# Altium schematic sheet ad.SchDoc
size A0
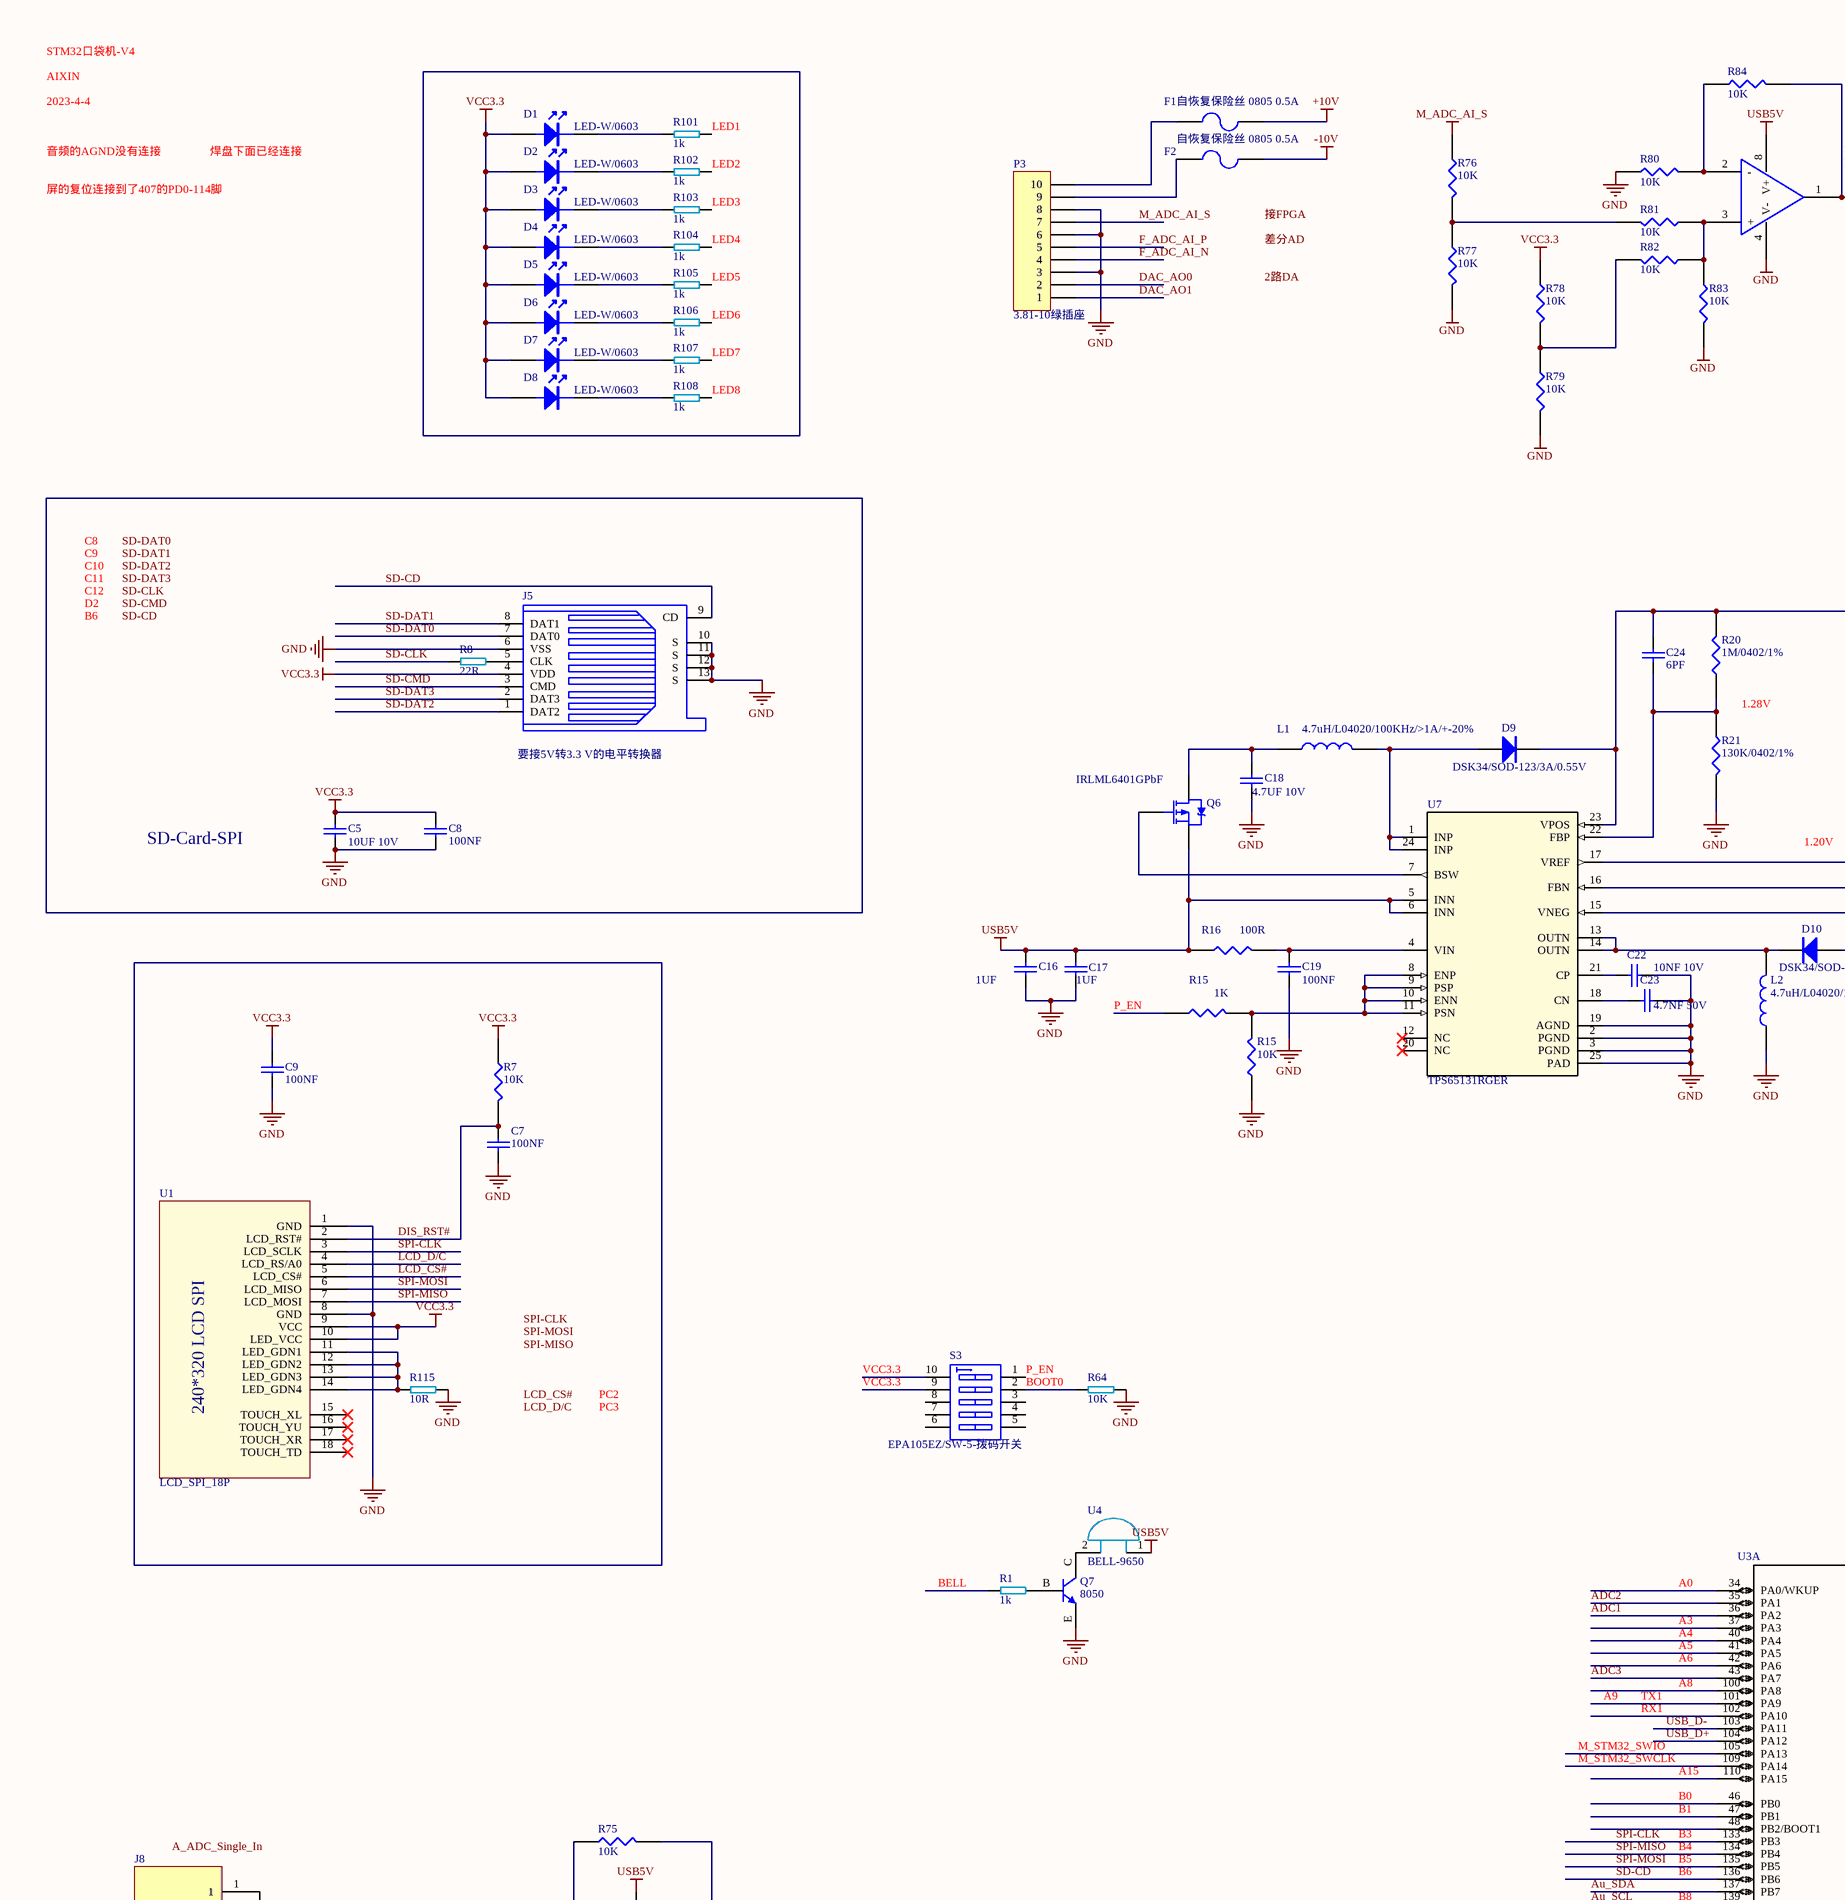
[diagram p0: ad.SchDoc, top left]
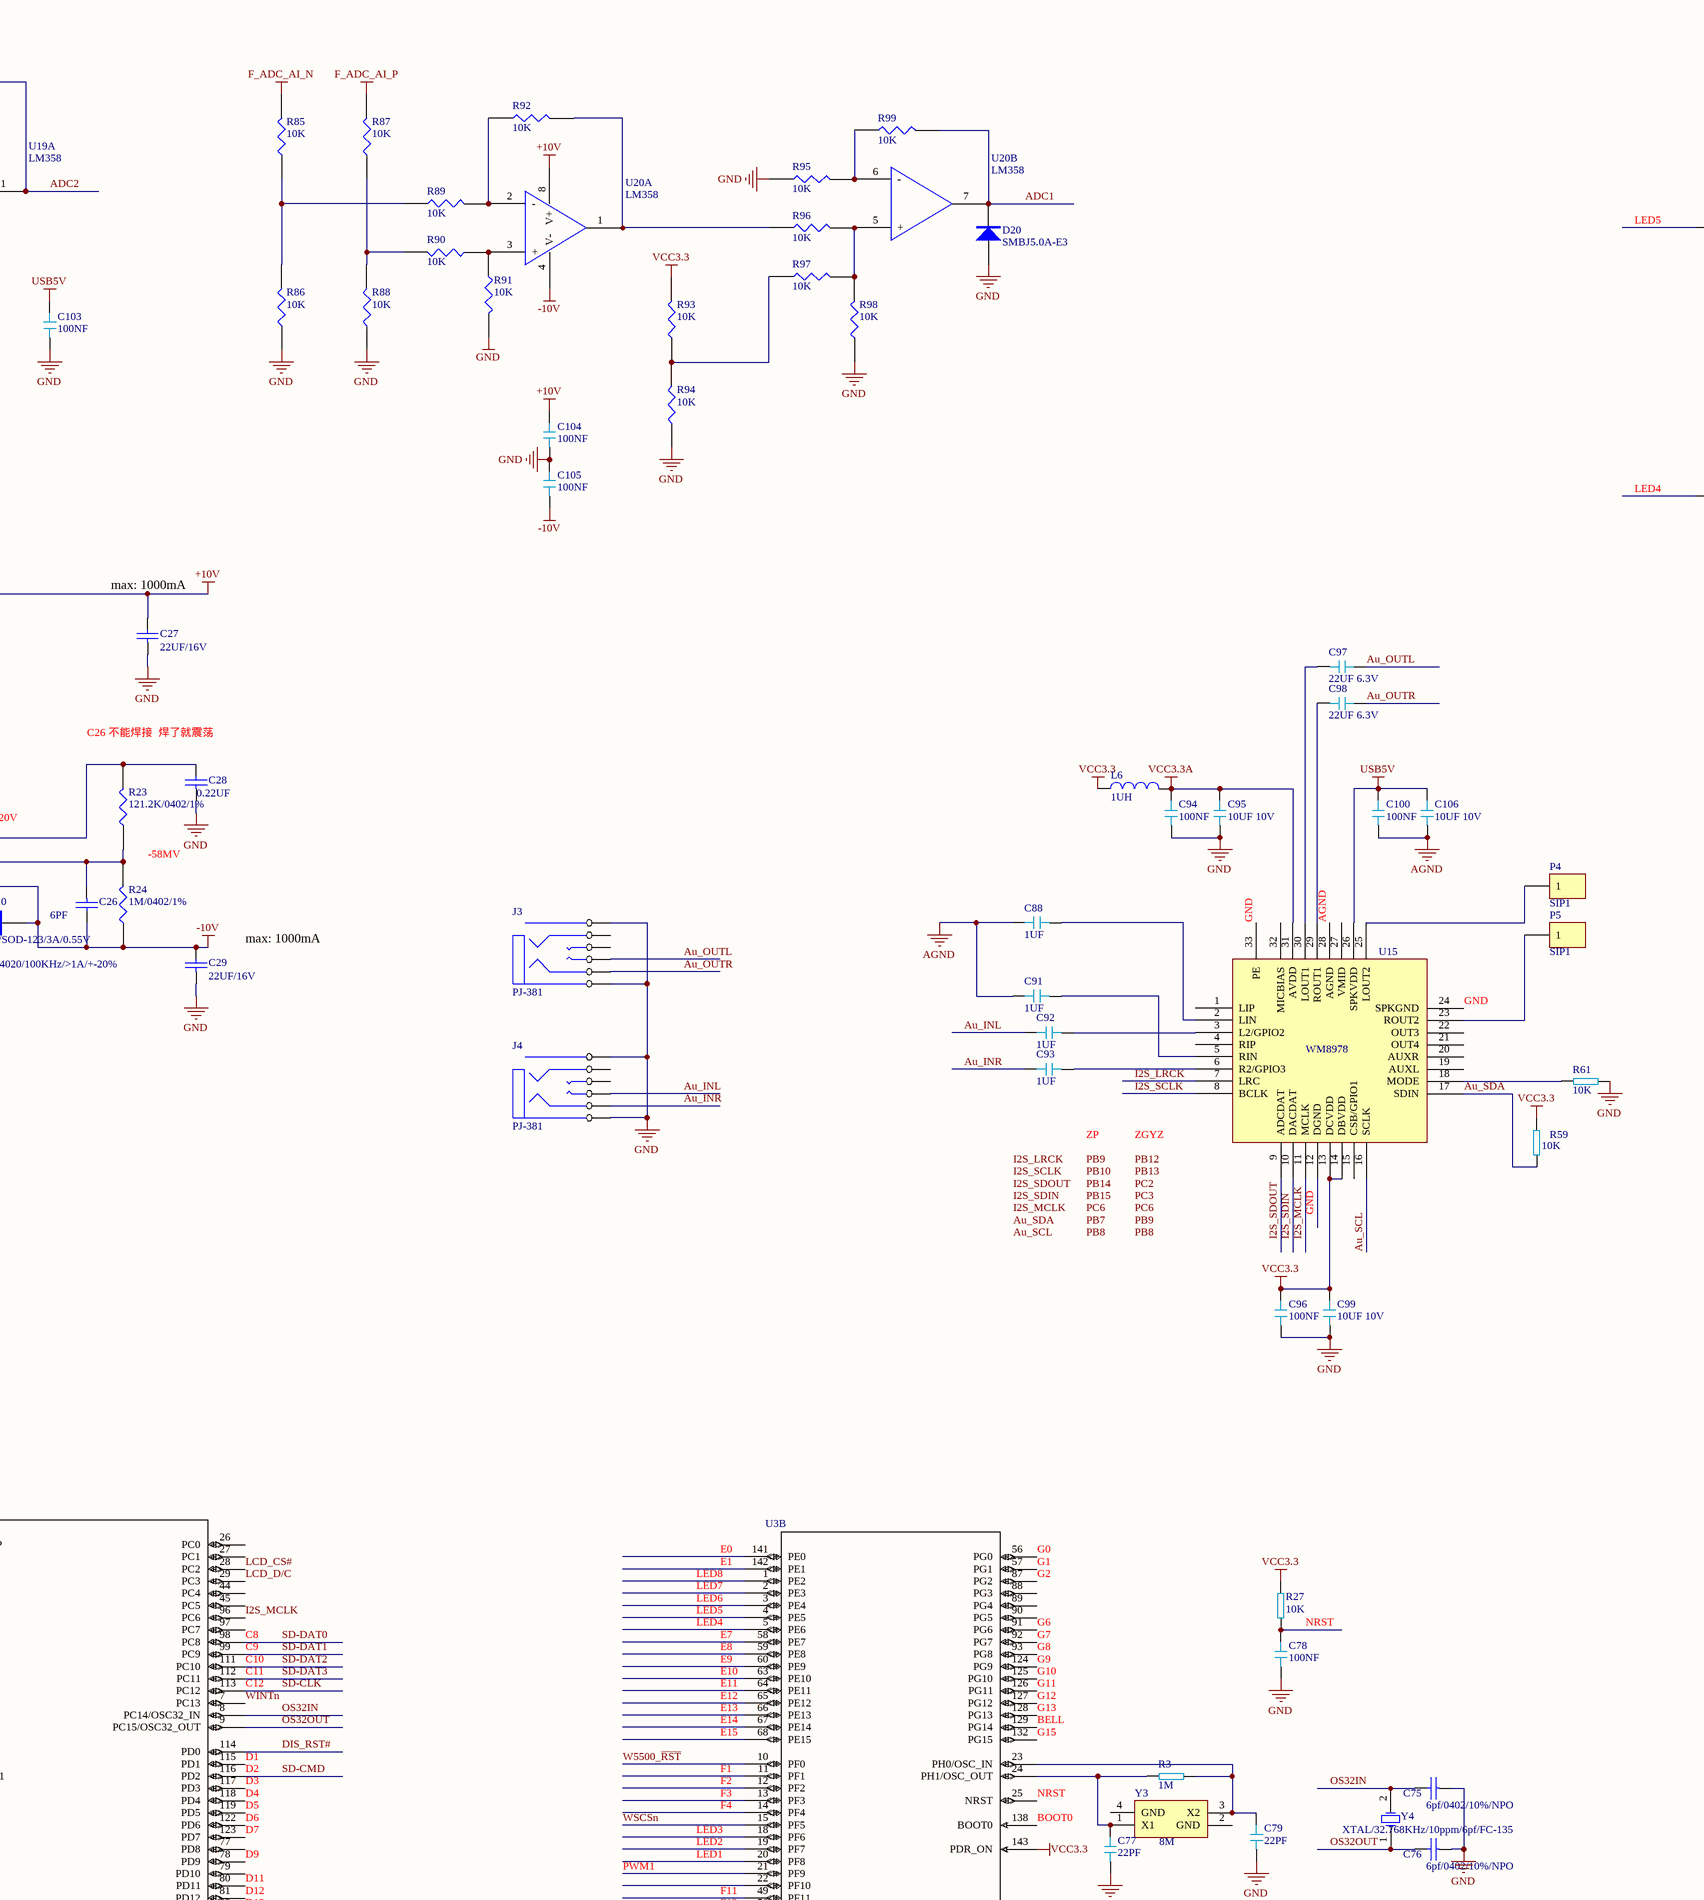
[diagram p1: ad.SchDoc, top middle]
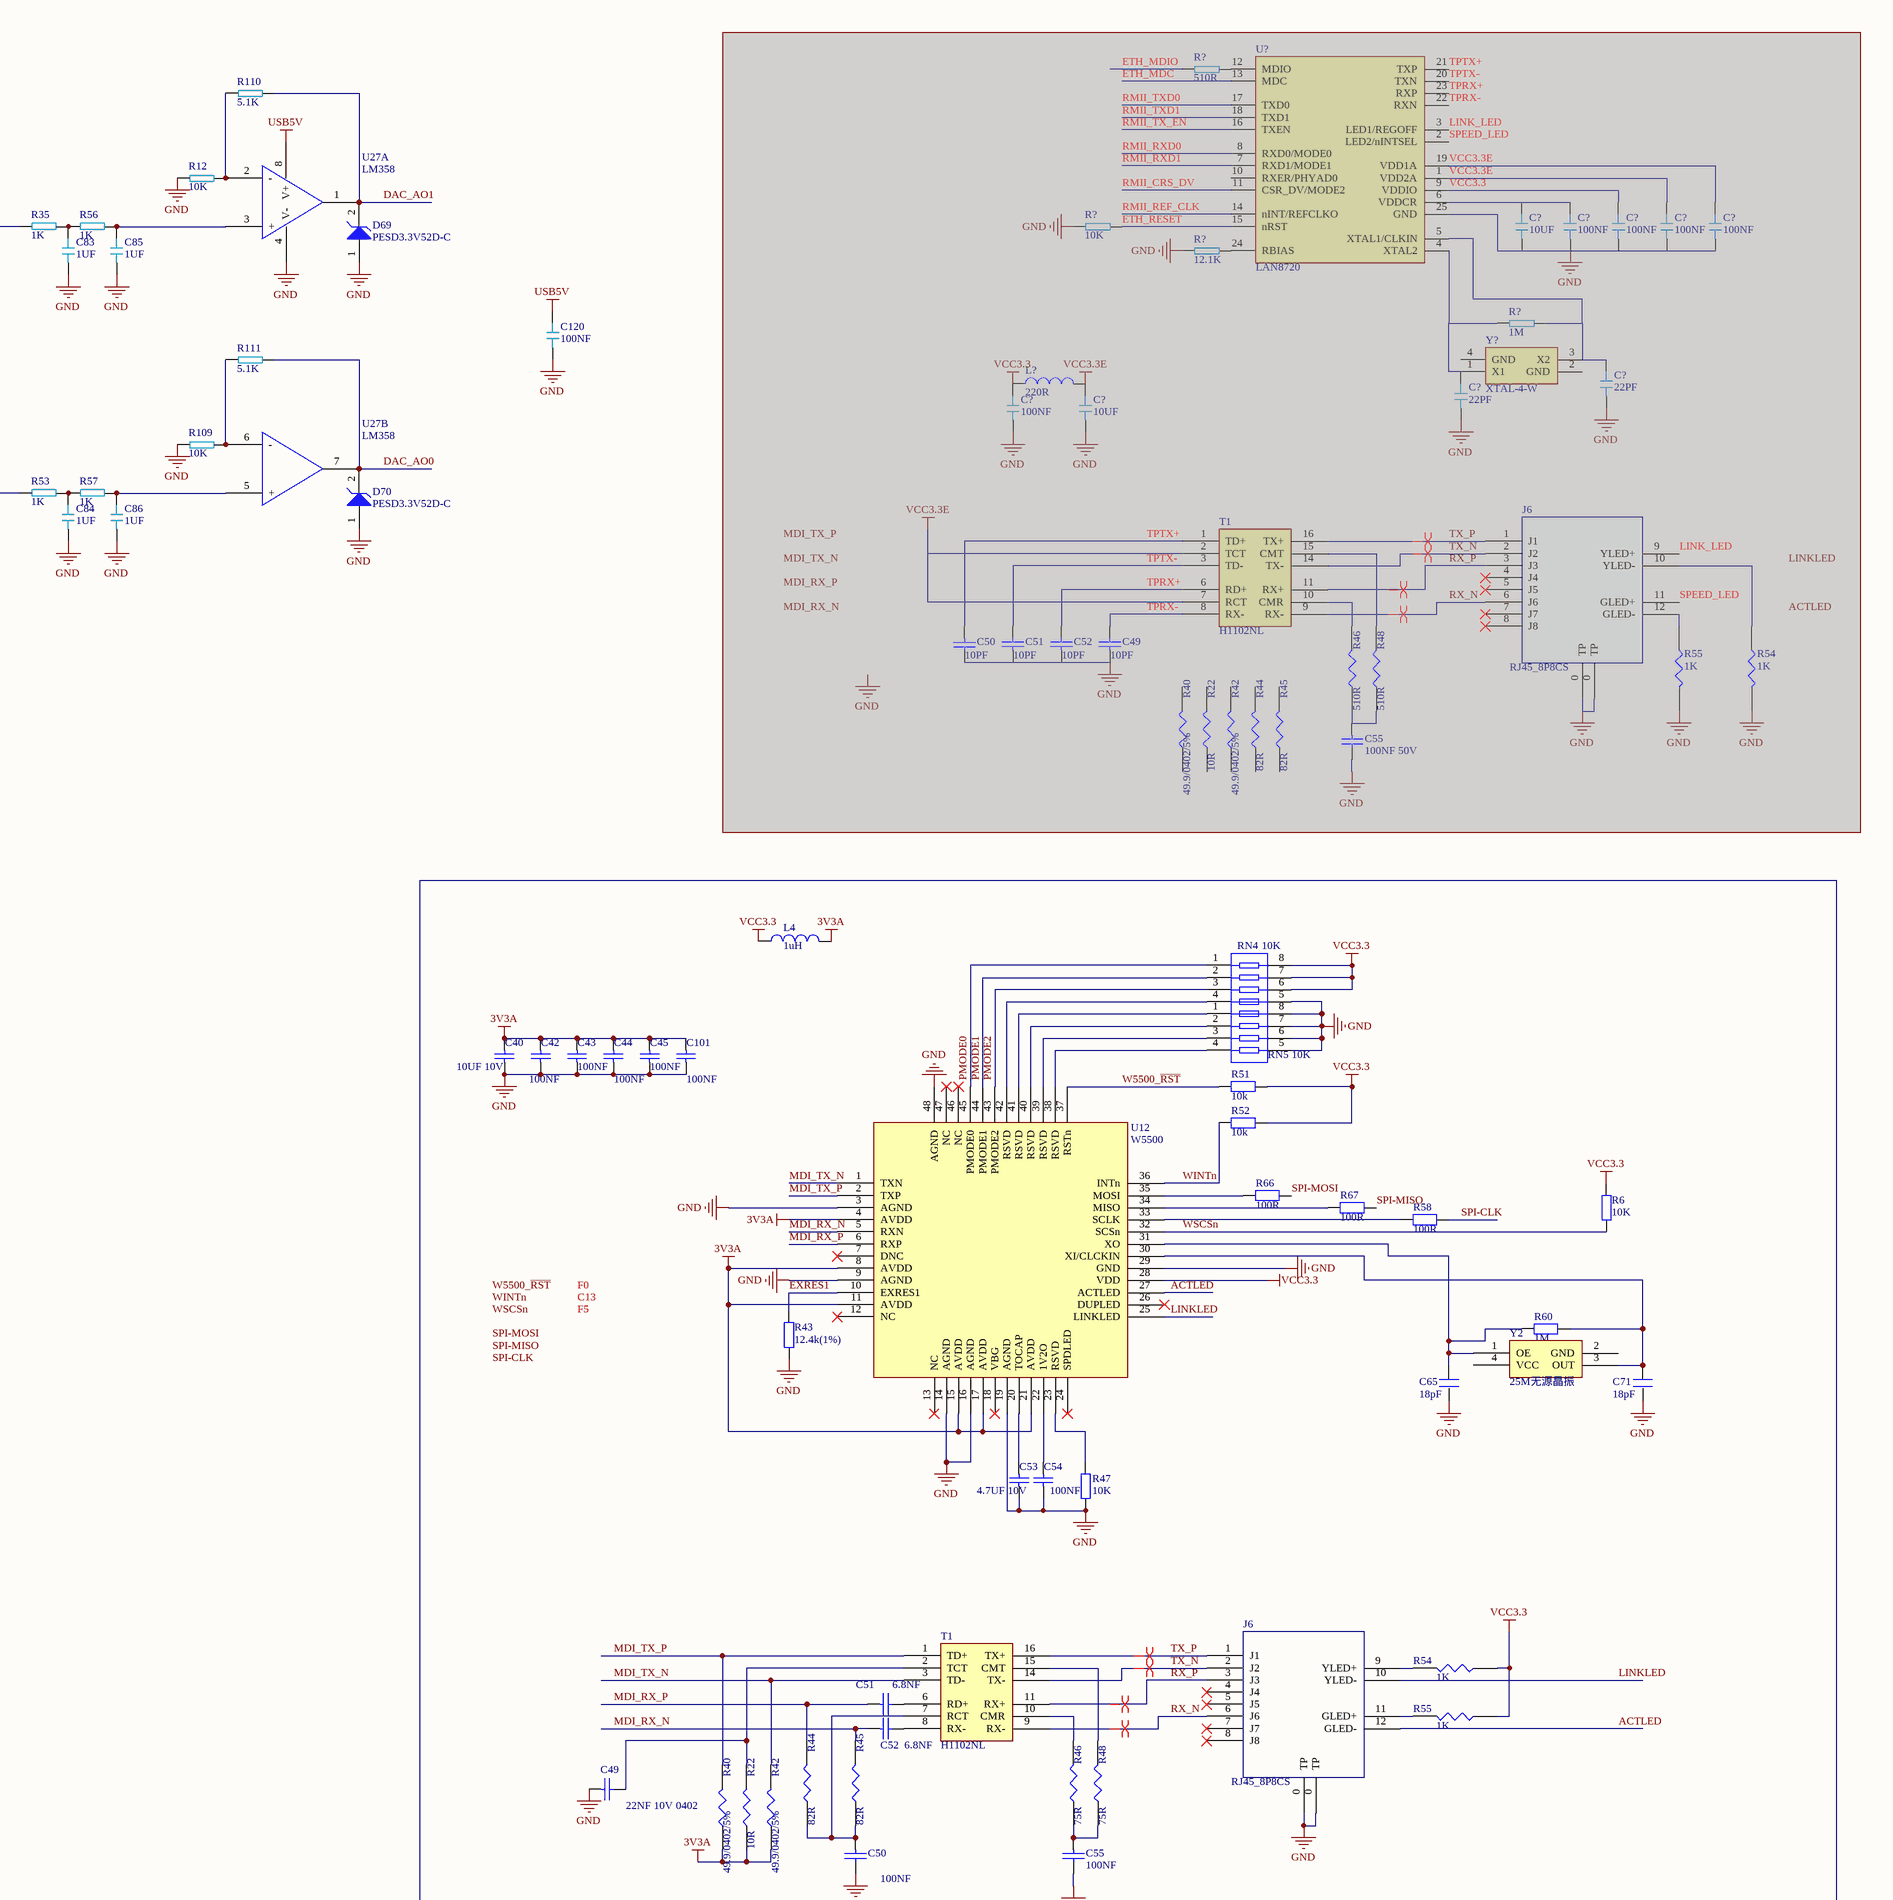
[diagram p2: ad.SchDoc, top right]
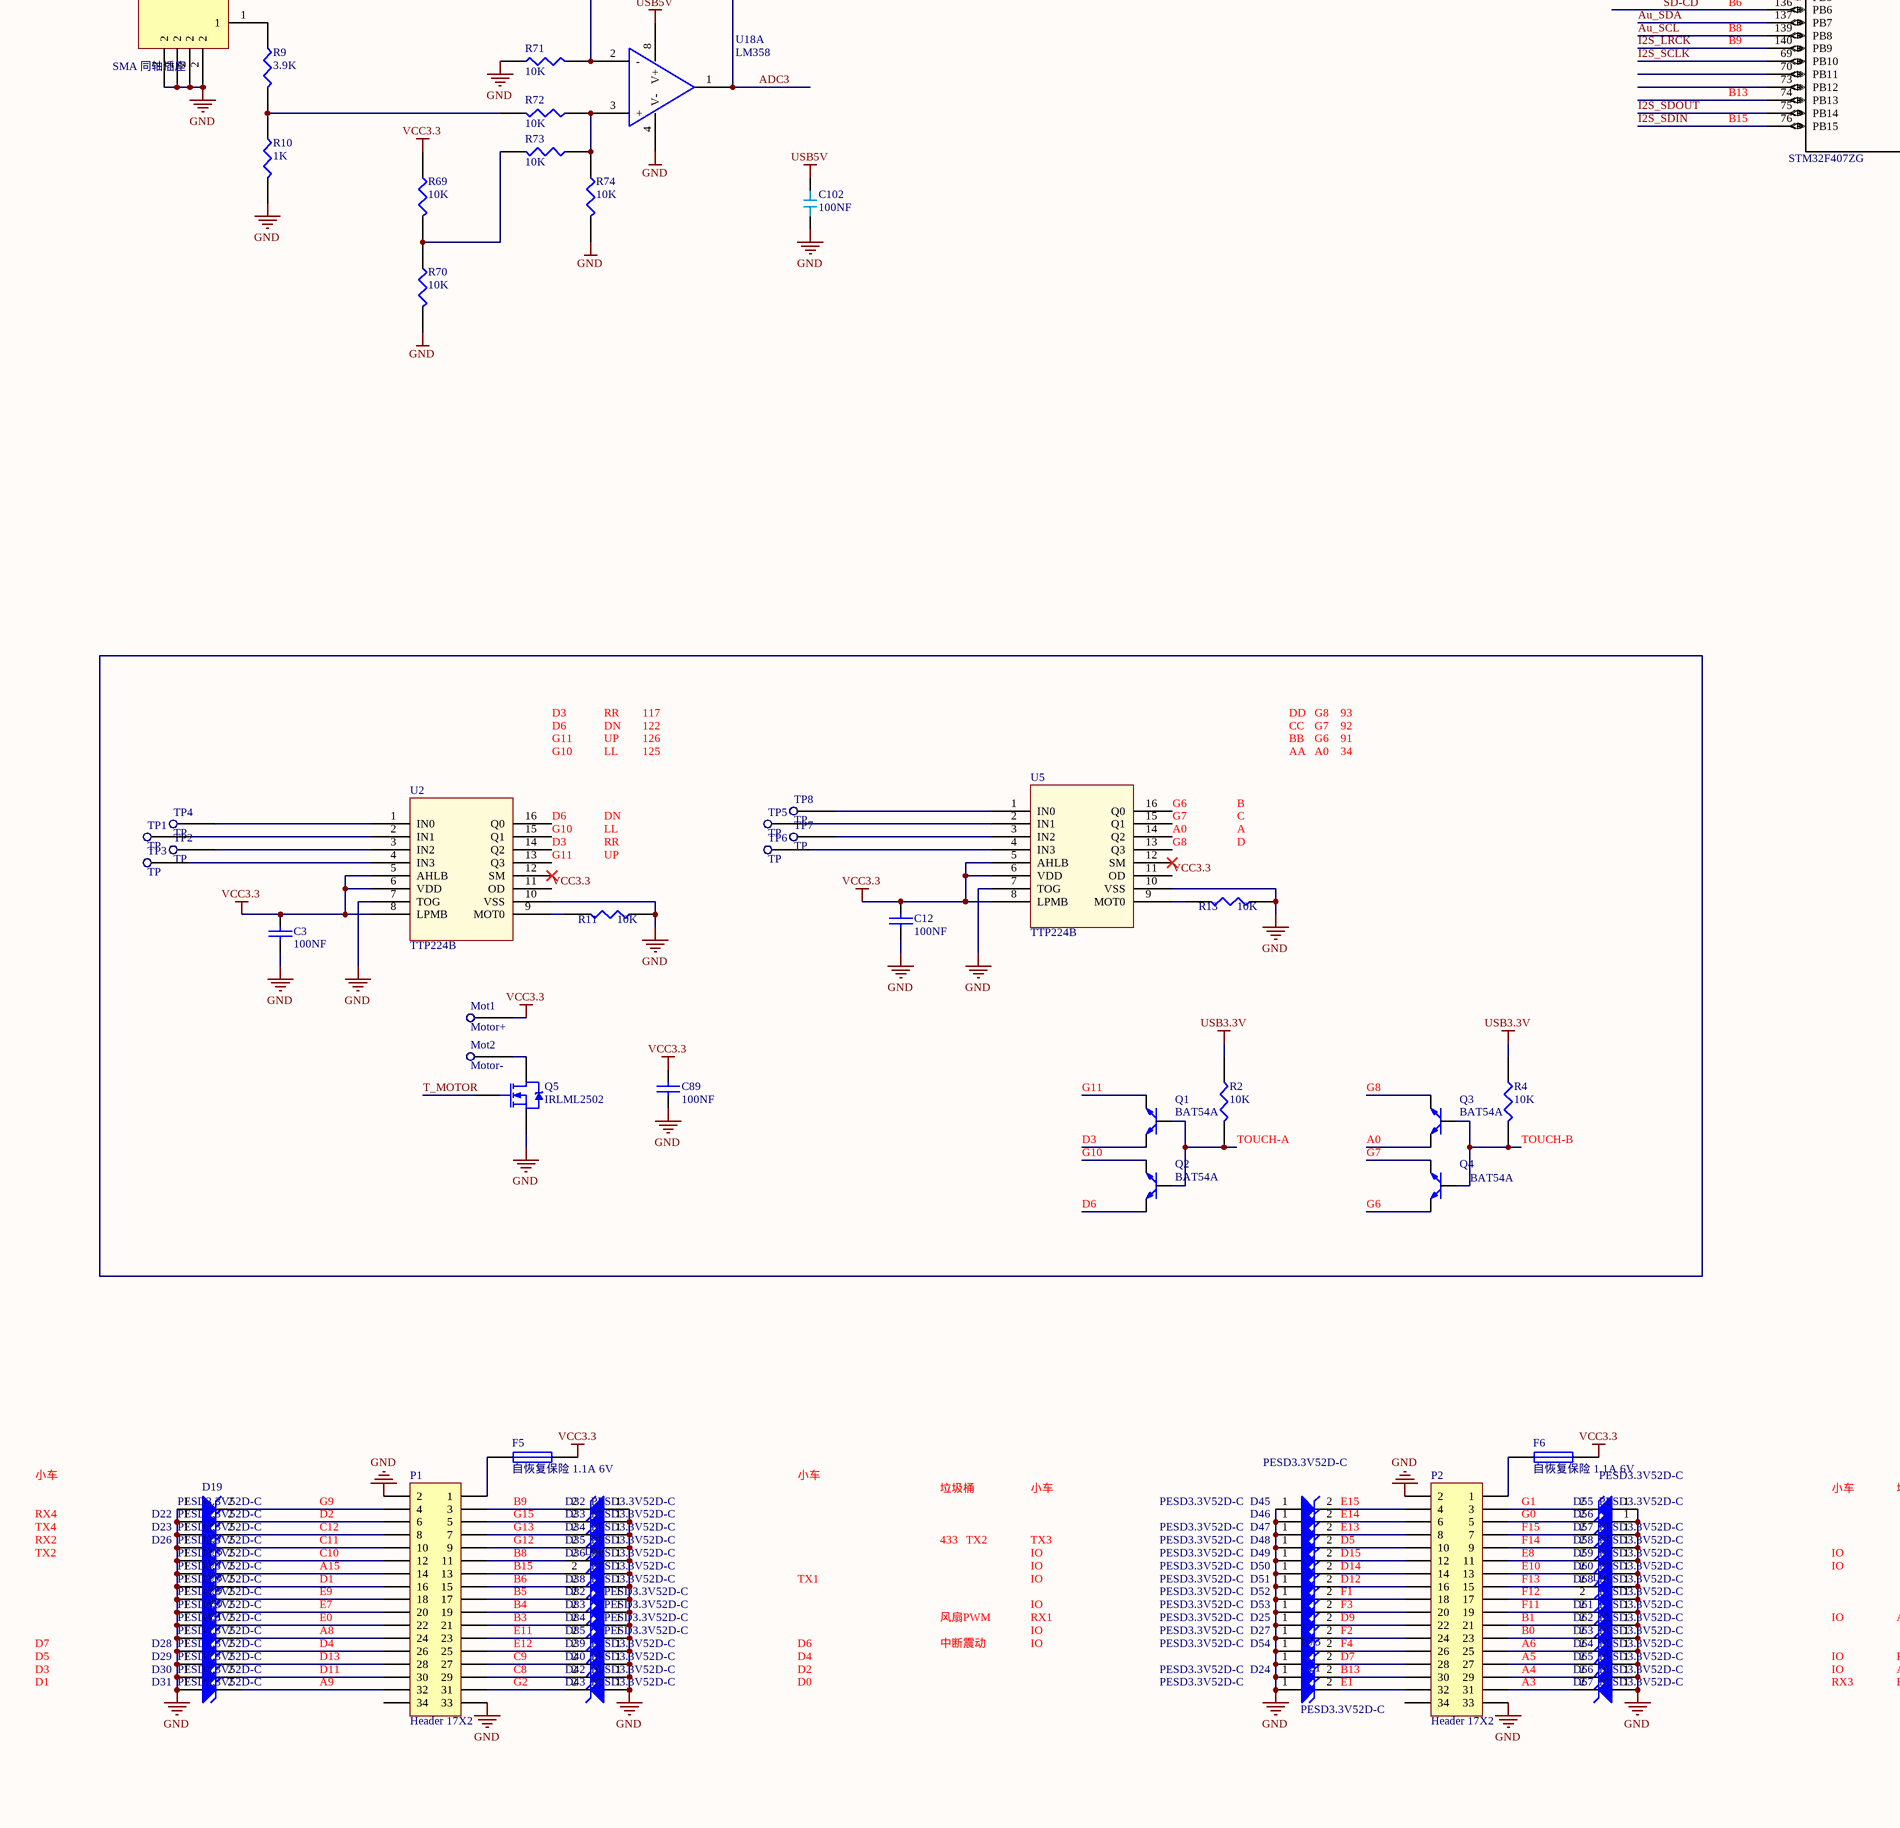
[diagram p3: ad.SchDoc, bottom left]
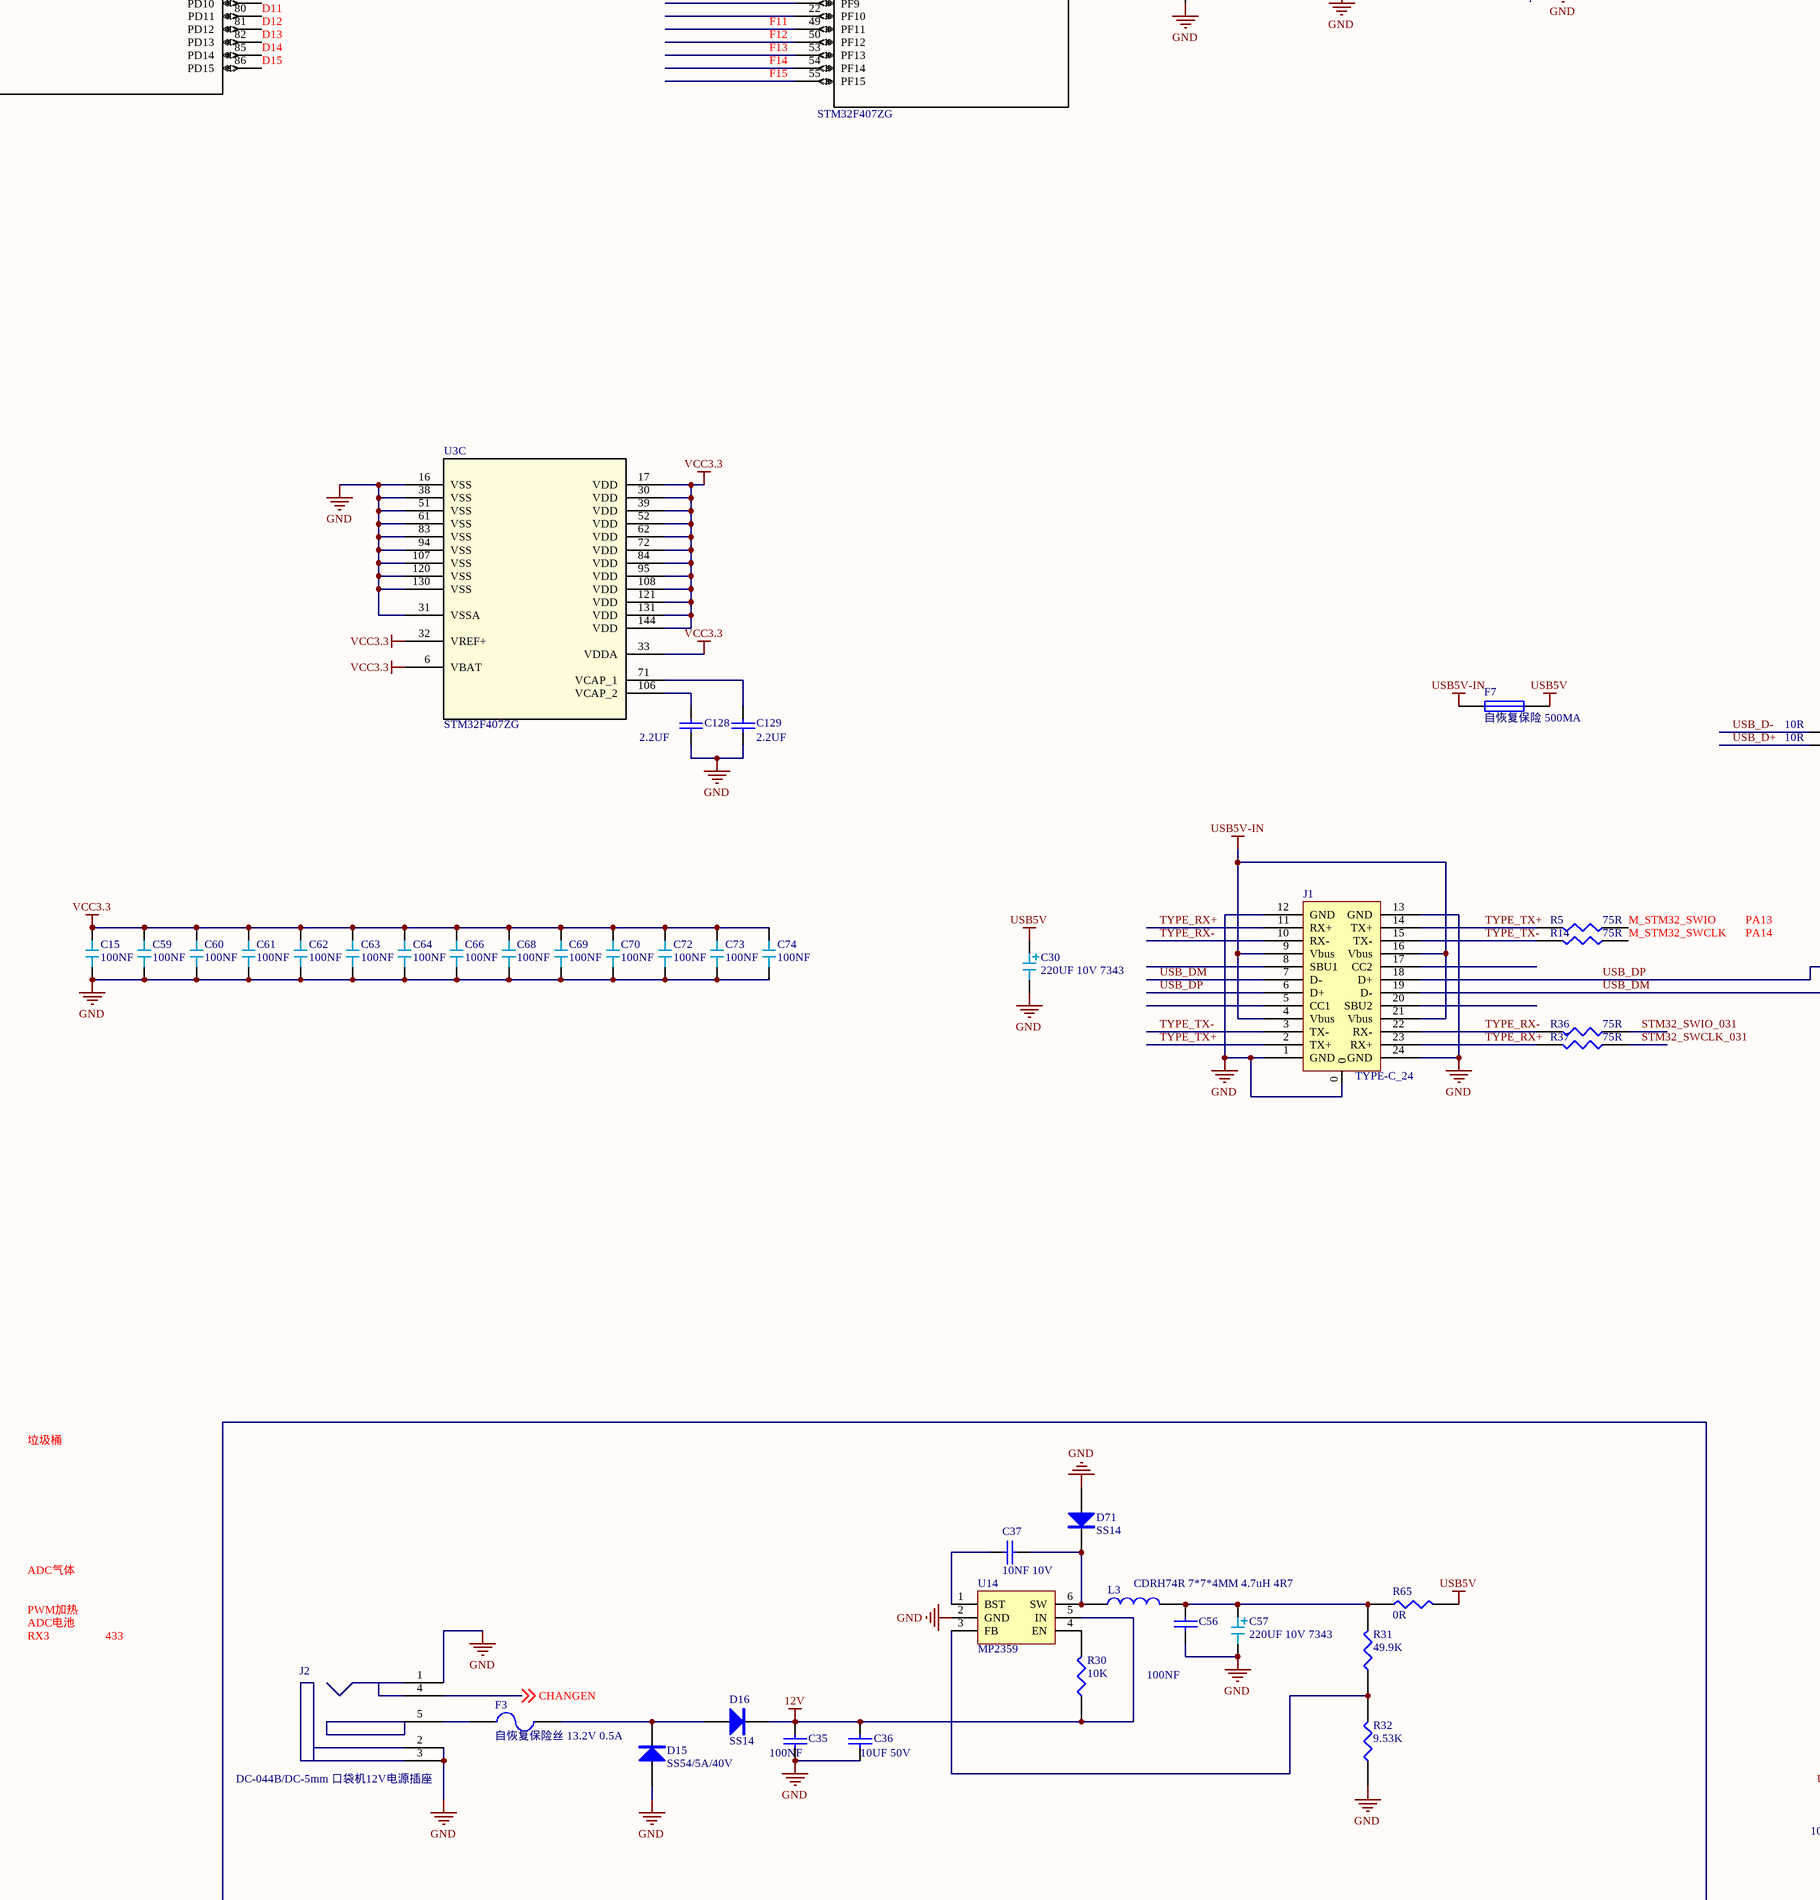
[diagram p4: ad.SchDoc, bottom middle]
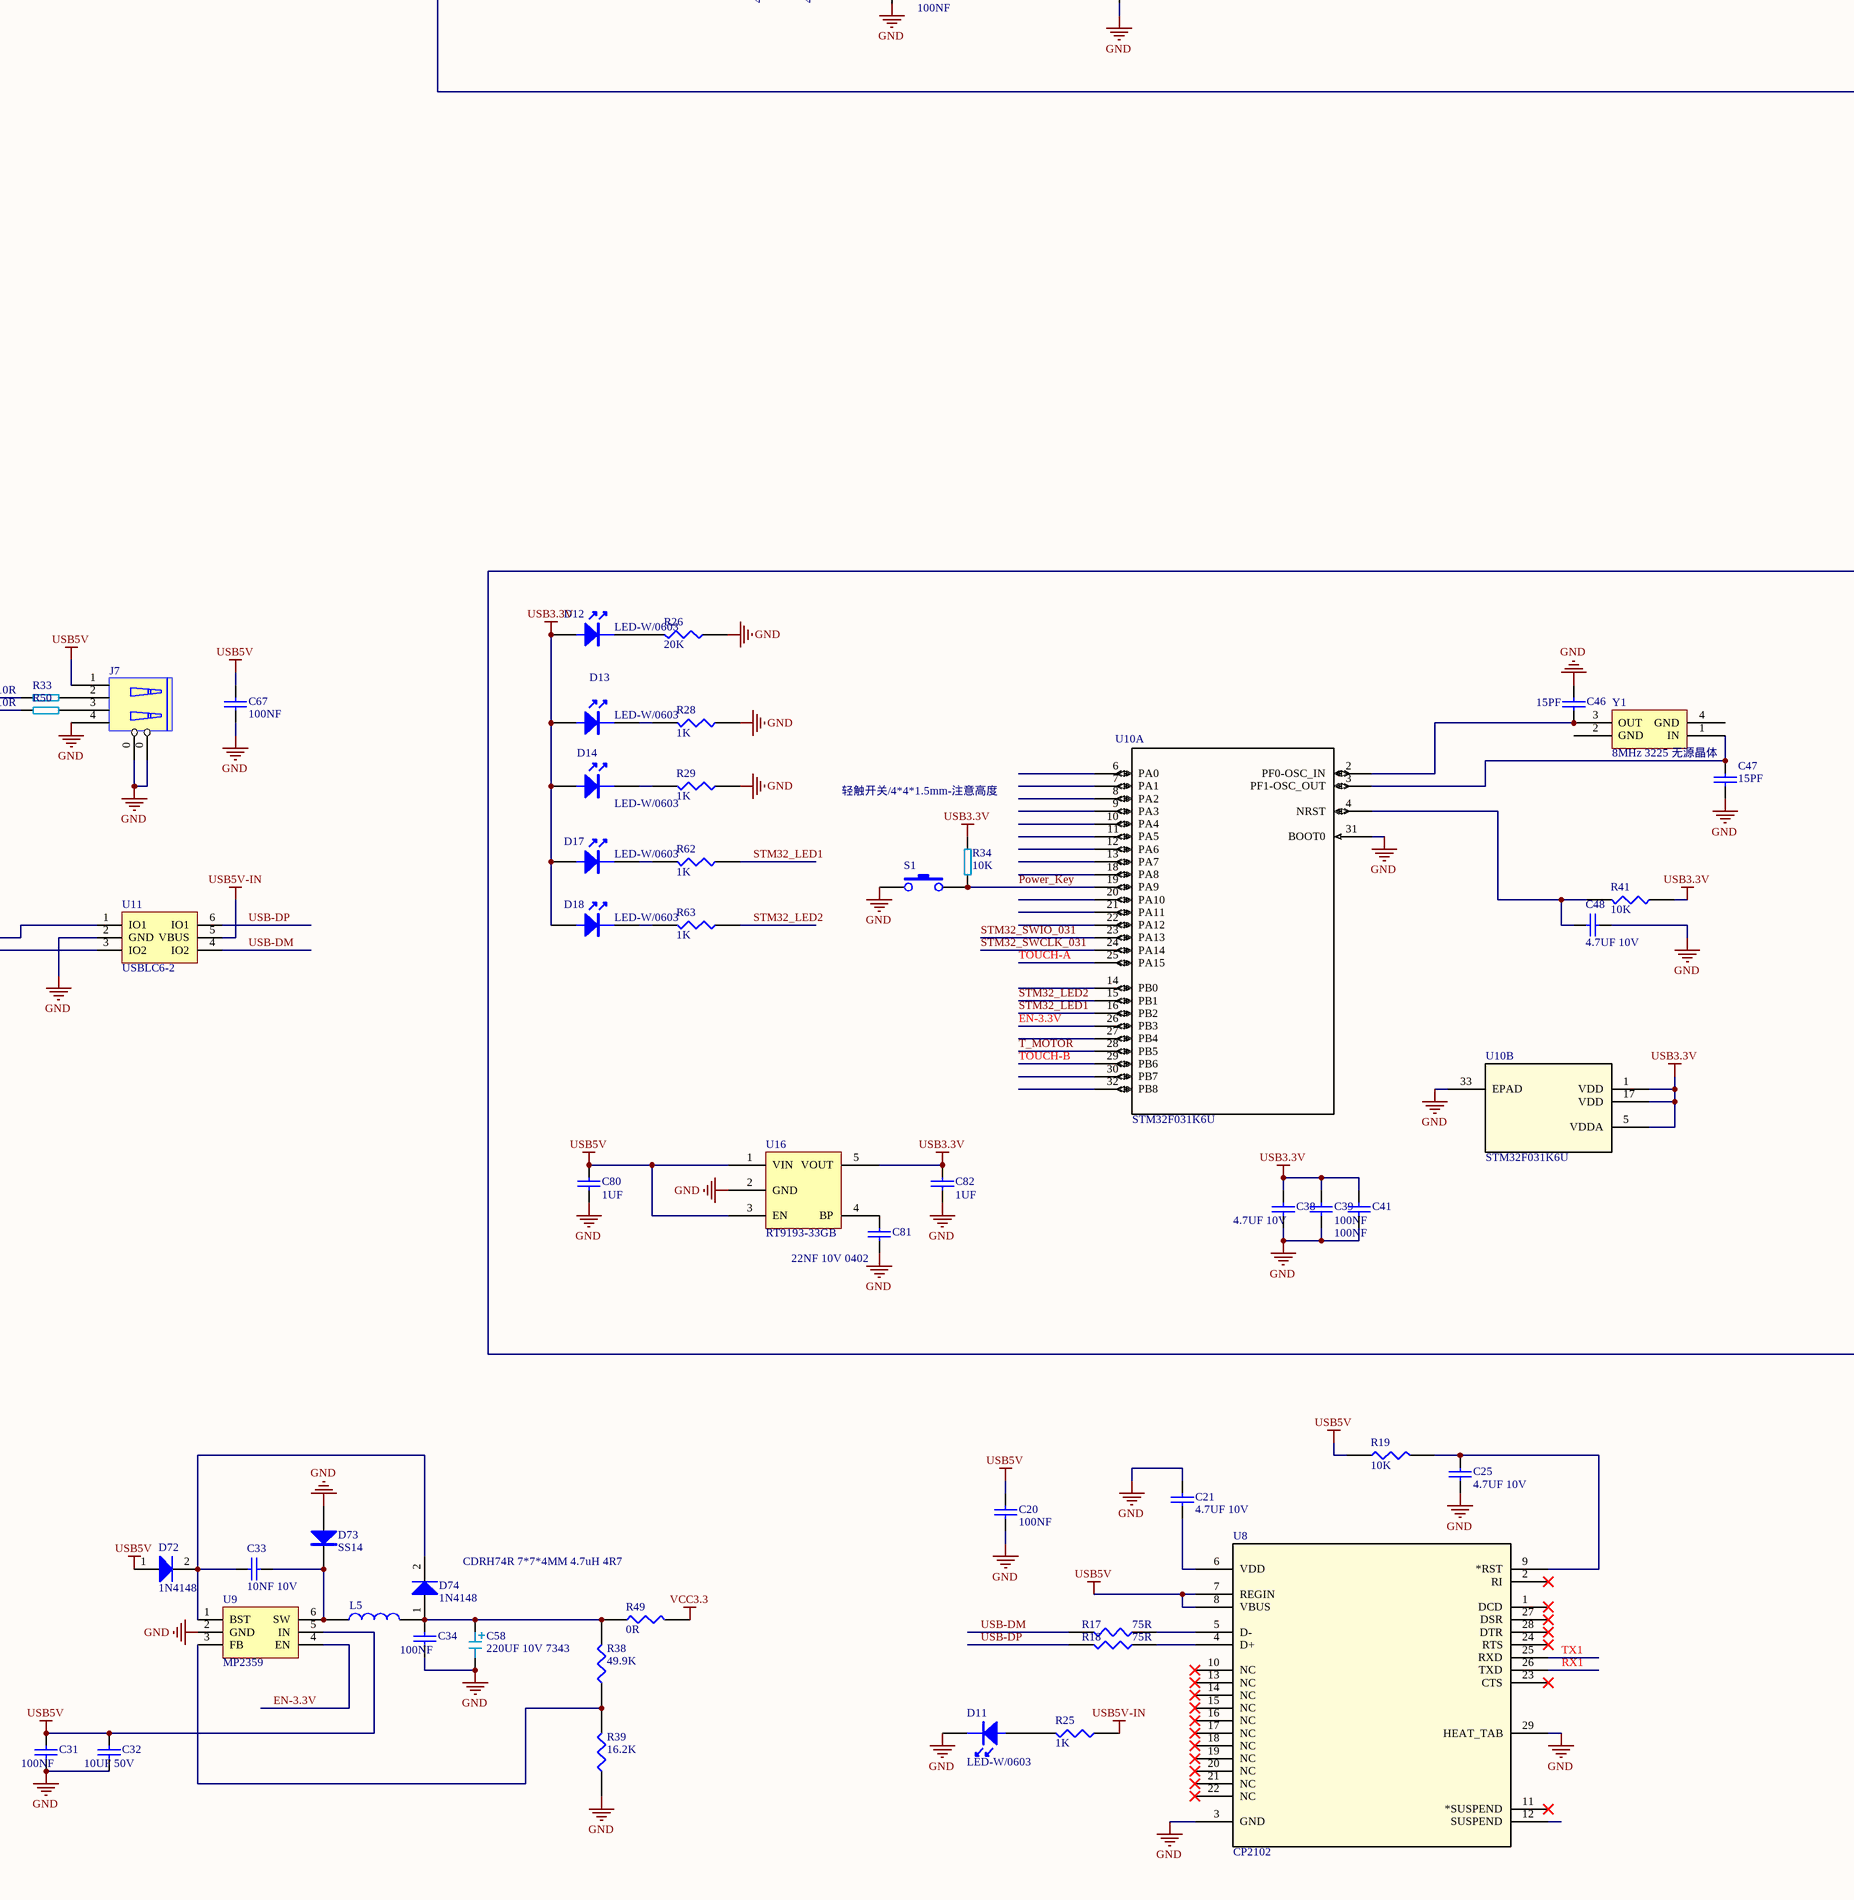
[diagram p5: ad.SchDoc, bottom right]

## Parts
(Parts that share a designator on the sheet are numbered #1, #2 ... from top to bottom, then left to right.)
C3  100NF  [C0402]
C5  10UF 10V  [C0603]
C7  100NF  [C0402]
C8  100NF  [C0402]
C9  100NF  [C0402]
C12  100NF  [C0402]
C15  100NF  [C0402]
C16  1UF  [C0402]
C17  1UF  [C0402]
C18  4.7UF 10V  [C0402]
C19  100NF  [C0402]
C20  100NF  [C0402]
C21  4.7UF 10V  [C0402]
C22  10NF 10V  [C0402]
C23  4.7NF 50V  [C0402]
C24  6PF  [C0402]
C25  4.7UF 10V  [C0402]
C26  6PF  [C0402]
C27  22UF/16V  [C0805]
C28  0.22UF  [C0402]
C29  22UF/16V  [C0805]
C30  220UF 10V 7343  [C7343+]
C31  100NF  [C0402]
C32  10UF 50V  [C0805]
C33  10NF 10V  [C0402]
C34  100NF  [C0402]
C35  100NF  [C0402]
C36  10UF 50V  [C0805]
C37  10NF 10V  [C0402]
C38  4.7UF 10V  [C0402]
C39  100NF  [C0402]
C40  10UF 10V  [C0603]
C41  100NF  [C0402]
C42  100NF  [C0402]
C43  100NF  [C0402]
C44  100NF  [C0402]
C45  100NF  [C0402]
C46  15PF  [C0402]
C47  15PF  [C0402]
C48  4.7UF 10V  [C0402]
C49#1  10PF  [C0402]  (masked out: inside a compile mask, not in the netlist)
C49#2  22NF 10V 0402  [C0402]
C50#1  10PF  [C0402]  (masked out: inside a compile mask, not in the netlist)
C50#2  100NF  [C0402]
C51#1  10PF  [C0402]  (masked out: inside a compile mask, not in the netlist)
C51#2  6.8NF  [C0402]
C52#1  10PF  [C0402]  (masked out: inside a compile mask, not in the netlist)
C52#2  6.8NF  [C0402]
C53  4.7UF 10V  [C0402]
C54  100NF  [C0402]
C55#1  100NF 50V  [C0402]  (masked out: inside a compile mask, not in the netlist)
C55#2  100NF  [C0402]
C56  100NF  [C0402]
C57  220UF 10V 7343  [C7343+]
C58  220UF 10V 7343  [C7343+]
C59  100NF  [C0402]
C60  100NF  [C0402]
C61  100NF  [C0402]
C62  100NF  [C0402]
C63  100NF  [C0402]
C64  100NF  [C0402]
C65  18pF  [C0402]
C66  100NF  [C0402]
C67  100NF  [C0402]
C68  100NF  [C0402]
C69  100NF  [C0402]
C70  100NF  [C0402]
C71  18pF  [C0402]
C72  100NF  [C0402]
C73  100NF  [C0402]
C74  100NF  [C0402]
C75  6pf/0402/10%/NPO  [C0402]
C76  6pf/0402/10%/NPO  [C0402]
C77  22PF  [C0402]
C78  100NF  [C0402]
C79  22PF  [C0402]
C80  1UF  [C0402]
C81  22NF 10V 0402  [C0402]
C82  1UF  [C0402]
C83  1UF  [C0402]
C84  1UF  [C0402]
C85  1UF  [C0402]
C86  1UF  [C0402]
C88  1UF  [C0402]
C89  100NF  [C0402]
C91  1UF  [C0402]
C92  1UF  [C0402]
C93  1UF  [C0402]
C94  100NF  [C0402]
C95  10UF 10V  [C0402]
C96  100NF  [C0402]
C97  22UF 6.3V  [C0603]
C98  22UF 6.3V  [C0603]
C99  10UF 10V  [C0402]
C100  100NF  [C0402]
C101  100NF  [C0402]
C102  100NF  [C0402]
C103  100NF  [C0402]
C104  100NF  [C0402]
C105  100NF  [C0402]
C106  10UF 10V  [C0402]
C120  100NF  [C0402]
C128  2.2UF  [C0402]
C129  2.2UF  [C0402]
C?#1  10UF  [C0603]  (masked out: inside a compile mask, not in the netlist)
C?#2  100NF  [C0402]  (masked out: inside a compile mask, not in the netlist)
C?#3  100NF  [C0402]  (masked out: inside a compile mask, not in the netlist)
C?#4  100NF  [C0402]  (masked out: inside a compile mask, not in the netlist)
C?#5  100NF  [C0402]  (masked out: inside a compile mask, not in the netlist)
C?#6  22PF  [C0402]  (masked out: inside a compile mask, not in the netlist)
C?#7  22PF  [C0402]  (masked out: inside a compile mask, not in the netlist)
C?#8  100NF  [C0402]  (masked out: inside a compile mask, not in the netlist)
C?#9  10UF  [C0603]  (masked out: inside a compile mask, not in the netlist)
D1  LED-W/0603  [D0603]
D2  LED-W/0603  [D0603]
D3  LED-W/0603  [D0603]
D4  LED-W/0603  [D0603]
D5  LED-W/0603  [D0603]
D6  LED-W/0603  [D0603]
D7  LED-W/0603  [D0603]
D8  LED-W/0603  [D0603]
D9  DSK34/SOD-123/3A/0.55V  [SOD-123]
D10  DSK34/SOD-123/3A/0.55V  [SOD-123]
D11  LED-W/0603  [D0603]
D12  LED-W/0603  [D0603]
D13  LED-W/0603  [D0603]
D14  LED-W/0603  [D0603]
D15  SS54/5A/40V  [SMB]
D16  SS14  [SMA]
D17  LED-W/0603  [D0603]
D18  LED-W/0603  [D0603]
D19  PESD3.3V52D-C  [SOD523]
D20  SMBJ5.0A-E3  [SMB]
D21  PESD3.3V52D-C  [SOD523]
D22  PESD3.3V52D-C  [SOD523]
D23  PESD3.3V52D-C  [SOD523]
D24  PESD3.3V52D-C  [SOD523]
D25  PESD3.3V52D-C  [SOD523]
D26  PESD3.3V52D-C  [SOD523]
D27  PESD3.3V52D-C  [SOD523]
D28  PESD3.3V52D-C  [SOD523]
D29  PESD3.3V52D-C  [SOD523]
D30  PESD3.3V52D-C  [SOD523]
D31  PESD3.3V52D-C  [SOD523]
D32  PESD3.3V52D-C  [SOD523]
D33  PESD3.3V52D-C  [SOD523]
D34  PESD3.3V52D-C  [SOD523]
D35  PESD3.3V52D-C  [SOD523]
D36  PESD3.3V52D-C  [SOD523]
D37  PESD3.3V52D-C  [SOD523]
D38  PESD3.3V52D-C  [SOD523]
D39  PESD3.3V52D-C  [SOD523]
D40  PESD3.3V52D-C  [SOD523]
D42  PESD3.3V52D-C  [SOD523]
D43  PESD3.3V52D-C  [SOD523]
D44  PESD3.3V52D-C  [SOD523]
D45  PESD3.3V52D-C  [SOD523]
D46  PESD3.3V52D-C  [SOD523]
D47  PESD3.3V52D-C  [SOD523]
D48  PESD3.3V52D-C  [SOD523]
D49  PESD3.3V52D-C  [SOD523]
D50  PESD3.3V52D-C  [SOD523]
D51  PESD3.3V52D-C  [SOD523]
D52  PESD3.3V52D-C  [SOD523]
D53  PESD3.3V52D-C  [SOD523]
D54  PESD3.3V52D-C  [SOD523]
D55  PESD3.3V52D-C  [SOD523]
D56  PESD3.3V52D-C  [SOD523]
D57  PESD3.3V52D-C  [SOD523]
D58  PESD3.3V52D-C  [SOD523]
D59  PESD3.3V52D-C  [SOD523]
D60  PESD3.3V52D-C  [SOD523]
D61  PESD3.3V52D-C  [SOD523]
D62  PESD3.3V52D-C  [SOD523]
D63  PESD3.3V52D-C  [SOD523]
D64  PESD3.3V52D-C  [SOD523]
D65  PESD3.3V52D-C  [SOD523]
D66  PESD3.3V52D-C  [SOD523]
D67  PESD3.3V52D-C  [SOD523]
D68  PESD3.3V52D-C  [SOD523]
D69  PESD3.3V52D-C  [SOD523]
D70  PESD3.3V52D-C  [SOD523]
D71  SS14  [SMA]
D72  1N4148  [SOD323]
D73  SS14  [SMA]
D74  1N4148  [SOD323]
D75  PESD3.3V52D-C  [SOD523]
D76  PESD3.3V52D-C  [SOD523]
D77  PESD3.3V52D-C  [SOD523]
D78  PESD3.3V52D-C  [SOD523]
D79  PESD3.3V52D-C  [SOD523]
D80  PESD3.3V52D-C  [SOD523]
D81  PESD3.3V52D-C  [SOD523]
D82  PESD3.3V52D-C  [SOD523]
D83  PESD3.3V52D-C  [SOD523]
D84  PESD3.3V52D-C  [SOD523]
D85  PESD3.3V52D-C  [SOD523]
D86  PESD3.3V52D-C  [SOD523]
F1  自恢复保险丝 0805 0.5A  [R0805]
F2  自恢复保险丝 0805 0.5A  [R0805]
F3  自恢复保险丝 13.2V 0.5A  [C1210]
F5  自恢复保险 1.1A 6V  [R0805]
F6  自恢复保险 1.1A 6V  [R0805]
F7  自恢复保险 500MA  [R0805]
J1  TYPE-C_24  [TYPE-C24P]
J2  DC-044B/DC-5mm 口袋机12V电源插座  [DC-5mm]
J3  PJ-381  [PJ381]
J4  PJ-381  [PJ381]
J5  TF卡插座  [TF-card]  (value not drawn)
J6#1  RJ45_8P8CS  [RJ45-8P8CS]  (masked out: inside a compile mask, not in the netlist)
J6#2  RJ45_8P8CS  [RJ45-8P8CS]
J7  USB-HOST插座  [USB-19]  (value not drawn)
J8  SMA 同轴插座  [MCX-KHD]
L1  4.7uH/L04020/100KHz/>1A/+-20%  [L04020]
L2  4.7uH/L04020/100KHz/>1A/+-20%  [L04020]
L3  CDRH74R 7*7*4MM 4.7uH 4R7  [l-CDRH74R 7*7*4MM]
L4  1uH  [R0805]
L5  CDRH74R 7*7*4MM 4.7uH 4R7  [l-CDRH74R 7*7*4MM]
L6  1UH  [R0805]
L?  220R  [R0805]  (masked out: inside a compile mask, not in the netlist)
Mot1  Motor+  [TP]
Mot2  Motor-  [TP]
P1  Header 17X2  [HX_254_2x17]
P2  Header 17X2  [HX_254_2x17]
P3  3.81-10绿插座  [J-381]
P4  SIP1  [test]
P5  SIP1  [test]
Q1  BAT54A  [SOT23-123]
Q2  BAT54A  [SOT23-123]
Q3  BAT54A  [SOT23-123]
Q4  BAT54A  [SOT23-123]
Q5  IRLML2502  [SOT-23]
Q6  IRLML6401GPbF  [SOT-23]
Q7  8050  [SOT-23]
R1  1k  [R0402]
R2  10K  [R0402]
R3  1M  [R0402]
R4  10K  [R0402]
R5  75R  [R0402]
R6  10K  [R0402]
R7  10K  [R0402]
R8  22R  [R0402]
R9  3.9K  [R0402]
R10  1K  [R0402]
R11  10K  [R0402]
R12  10K  [R0402]
R13  10K  [R0402]
R14  75R  [R0402]
R15#1  1K  [R0402]
R15#2  10K  [R0402]
R16  100R  [R0402]
R17  75R  [R0402]
R18  75R  [R0402]
R19  10K  [R0402]
R20  1M/0402/1%  [R0402]
R21  130K/0402/1%  [R0402]
R22#1  10R  [R0402]  (masked out: inside a compile mask, not in the netlist)
R22#2  10R  [R0402]
R23  121.2K/0402/1%  [R0402]
R24  1M/0402/1%  [R0402]
R25  1K  [R0402]
R26  20K  [R0402]
R27  10K  [R0402]
R28  1K  [R0402]
R29  1K  [R0402]
R30  10K  [R0402]
R31  49.9K  [R0402]
R32  9.53K  [R0402]
R33  10R  [R0402]
R34  10K  [R0402]
R35  1K  [R0402]
R36  75R  [R0402]
R37  75R  [R0402]
R38  49.9K  [R0402]
R39  16.2K  [R0402]
R40#1  49.9/0402/5%  [R0402]  (masked out: inside a compile mask, not in the netlist)
R40#2  49.9/0402/5%  [R0402]
R41  10K  [R0402]
R42#1  49.9/0402/5%  [R0402]  (masked out: inside a compile mask, not in the netlist)
R42#2  49.9/0402/5%  [R0402]
R43  12.4k(1%)  [R0402]
R44#1  82R  [R0402]  (masked out: inside a compile mask, not in the netlist)
R44#2  82R  [R0402]
R45#1  82R  [R0402]  (masked out: inside a compile mask, not in the netlist)
R45#2  82R  [R0402]
R46#1  510R  [R0402]  (masked out: inside a compile mask, not in the netlist)
R46#2  75R  [R0402]
R47  10K  [R0402]
R48#1  510R  [R0402]  (masked out: inside a compile mask, not in the netlist)
R48#2  75R  [R0402]
R49  0R  [R0805]
R50  10R  [R0402]
R51  10k  [R0402]
R52  10k  [R0402]
R53  1K  [R0402]
R54#1  1K  [R0402]  (masked out: inside a compile mask, not in the netlist)
R54#2  1K  [R0402]
R55#1  1K  [R0402]  (masked out: inside a compile mask, not in the netlist)
R55#2  1K  [R0402]
R56  1K  [R0402]
R57  1K  [R0402]
R58  100R  [R0402]
R59  10K  [R0402]
R60  1M  [R0402]
R61  10K  [R0402]
R62  1K  [R0402]
R63  1K  [R0402]
R64  10K  [R0402]
R65  0R  [R0805]
R66  100R  [R0402]
R67  100R  [R0402]
R69  10K  [R0402]
R70  10K  [R0402]
R71  10K  [R0402]
R72  10K  [R0402]
R73  10K  [R0402]
R74  10K  [R0402]
R75  10K  [R0402]
R76  10K  [R0402]
R77  10K  [R0402]
R78  10K  [R0402]
R79  10K  [R0402]
R80  10K  [R0402]
R81  10K  [R0402]
R82  10K  [R0402]
R83  10K  [R0402]
R84  10K  [R0402]
R85  10K  [R0402]
R86  10K  [R0402]
R87  10K  [R0402]
R88  10K  [R0402]
R89  10K  [R0402]
R90  10K  [R0402]
R91  10K  [R0402]
R92  10K  [R0402]
R93  10K  [R0402]
R94  10K  [R0402]
R95  10K  [R0402]
R96  10K  [R0402]
R97  10K  [R0402]
R98  10K  [R0402]
R99  10K  [R0402]
R101  1k  [R0402]
R102  1k  [R0402]
R103  1k  [R0402]
R104  1k  [R0402]
R105  1k  [R0402]
R106  1k  [R0402]
R107  1k  [R0402]
R108  1k  [R0402]
R109  10K  [R0402]
R110  5.1K  [R0402]
R111  5.1K  [R0402]
R115  10R  [R0402]
R?#1  510R  [R0402]  (masked out: inside a compile mask, not in the netlist)
R?#2  10K  [R0402]  (masked out: inside a compile mask, not in the netlist)
R?#3  12.1K  [R0402]  (masked out: inside a compile mask, not in the netlist)
R?#4  1M  [R0402]  (masked out: inside a compile mask, not in the netlist)
RN4  10K  [R0603-4]
RN5  10K  [R0603-4]
S1  轻触开关/4*4*1.5mm-注意高度  [KEY-4]
S3  EPA105EZ/SW-5-拨码开关  [EPA-5P]
T1#1  H1102NL  [H1102NL]  (masked out: inside a compile mask, not in the netlist)
T1#2  H1102NL  [H1102NL]
TP1  TP  [TOUCH-DIP]
TP2  TP  [TOUCH-DIP]
TP3  TP  [TOUCH-DIP]
TP4  TP  [TOUCH-DIP]
TP5  TP  [TOUCH-DIP]
TP6  TP  [TOUCH-DIP]
TP7  TP  [TOUCH-DIP]
TP8  TP  [TOUCH-DIP]
U1  LCD_SPI_18P  [LCD_16P]
U2  TTP224B  [TTP224B]
U3  STM32F407ZG  [LQFP144]  (parts A,B,C of 3)
U4  BELL-9650  [BELL-MLT-9650]
U5  TTP224B  [TTP224B]
U7  TPS65131RGER  [VQFN24]
U8  CP2102  [QFN28]
U9  MP2359  [SOT23-6]
U10  STM32F031K6U  [UFQFPN-32]  (parts A,B of 2)
U11  USBLC6-2  [SOT-23-6]
U12  W5500  [LQFP48]
U14  MP2359  [SOT23-6]
U15  WM8978  [QFN32-0.5]
U16  RT9193-33GB  [SOT23-5]
U18  LM358  [TSSOP8]  (part A of 2)
U19  LM358  [TSSOP8]  (part A of 2)
U20  LM358  [TSSOP8]  (parts A,B of 2)
U27  LM358  [TSSOP8]  (parts A,B of 2)
U?  LAN8720  [QFN24-0.5]  (masked out: inside a compile mask, not in the netlist)
Y1  8MHz 3225 无源晶体  [XATL_3225]
Y2  25M无源晶振  [XATL_3225]
Y3  8M  [XTAL-3225-4]
Y4  XTAL/32.768KHz/10ppm/6pf/FC-135  [FC-135R]
Y?  XTAL-4-W  [XTAL-3225-4]  (masked out: inside a compile mask, not in the netlist)

## Nets
3V3A: C40.2 C42.2 C43.2 C44.2 C45.2 C101.2 L4.2 R22#2.1 R40#2.1 R42#2.1 U12.4(AVDD) U12.8(AVDD) U12.11(AVDD) U12.15(AVDD) U12.17(AVDD) U12.21(AVDD)
12V: C35.2 C36.2 D16.K R30.1 U14.5(IN)
+10V: C24.1 C27.2 C104.2 D9.K F1.2 R20.2 U7.23(VPOS) U20.8(V+)
-10V: C26.2 C29.2 C105.1 D10.A F2.2 R24.1 U7.15(VNEG) U20.4(V-)
AGND: C88.2 C91.2 C100.1 C106.1 U15.28(AGND)
F_ADC_AI_N: P3.4 R85.2
F_ADC_AI_P: P3.5 R87.2
GND: C3.1 C5.1 C7.2 C8.2 C9.2 C12.1 C15.2 C16.2 C17.1 C18.1 C19.2 C20.2 C21.1 C22.2 C23.2 C25.2 C27.1 C28.1 C29.1 C30.2 C31.1 C32.1 C34.1 C35.1 C36.1 C38.2 C39.2 C40.1 C41.2 C42.1 C43.1 C44.1 C45.1 C46.1 C47.2 C48.2 C49#2.1 C50#2.2 C53.1 C54.1 C55#2.2 C56.1 C57.2 C58.2 C59.2 C60.2 C61.2 C62.2 C63.2 C64.2 C65.1 C66.2 C67.2 C68.2 C69.2 C70.2 C71.1 C72.2 C73.2 C74.2 C75.1 C76.1 C77.1 C78.1 C79.1 C80.2 C81.2 C82.2 C83.1 C84.1 C85.1 C86.1 C89.1 C94.1 C95.1 C96.1 C99.1 C101.1 C102.1 C103.1 C104.1 C105.2 C120.1 C128.2 C129.2 D11.K D15.A D19.1 D20.A D21.1 D22.1 D23.1 D24.1 D25.1 D26.1 D27.1 D28.1 D29.1 D30.1 D31.1 D32.1 D33.1 D34.1 D35.1 D36.1 D37.1 D38.1 D39.1 D40.1 D42.1 D43.1 D44.1 D45.1 D46.1 D47.1 D48.1 D49.1 D50.1 D51.1 D52.1 D53.1 D54.1 D55.1 D56.1 D57.1 D58.1 D59.1 D60.1 D61.1 D62.1 D63.1 D64.1 D65.1 D66.1 D67.1 D68.1 D69.1 D70.1 D71.A D73.A D75.1 D76.1 D77.1 D78.1 D79.1 D80.1 D81.1 D82.1 D83.1 D84.1 D85.1 D86.1 J1.0 J1.1(GND) J1.12(GND) J1.13(GND) J1.24(GND) J2.1(GND) J2.2(COM) J2.3(COM) J3.1(A) J3.6(F) J4.1(A) J4.6(F) J5.6(VSS) J5.10(S) J5.11(S) J5.12(S) J5.13(S) J6#2.0(TP) J7.0 J7.4 J8.2 L2.1 P1.2 P1.33 P2.2 P2.33 P3.3 P3.6 P3.8 Q5.2(S) Q7.E R10.2 R11.1 R12.1 R13.1 R15#2.1 R21.2 R26.1 R28.1 R29.1 R32.1 R39.1 R43.2 R47.1 R61.2 R64.2 R70.2 R71.1 R74.2 R77.2 R79.2 R80.1 R83.2 R86.1 R88.1 R91.2 R94.1 R95.1 R98.1 R109.1 R115.2 RN4.5 RN5.5 RN5.6 RN5.7 RN5.8 S1.1 U1.1(GND) U1.8(GND) U2.7(TOG) U2.10(VSS) U3.16(VSS) U3.31(VSSA) U3.38(VSS) U3.51(VSS) U3.61(VSS) U3.83(VSS) U3.94(VSS) U3.107(VSS) U3.120(VSS) U3.130(VSS) U5.7(TOG) U5.10(VSS) U7.2(PGND) U7.3(PGND) U7.19(AGND) U7.25(PAD) U8.3(GND) U8.29(HEAT_TAB) U9.2(GND) U10.31(BOOT0) U10.33(EPAD) U11.2(GND) U12.3(AGND) U12.9(AGND) U12.14(AGND) U12.16(AGND) U12.19(AGND) U12.29(GND) U12.48(AGND) U14.2(GND) U15.12(DGND) U15.24(SPKGND) U15.33(PE) U16.2(GND) U18.4(V-) U19.4(V-) U27.4(V-)
M_ADC_AI_S: P3.7 R76.1
USB3.3V: C38.1 C39.1 C41.1 C82.1 D12.A D13.A D14.A D17.A D18.A R2.1 R4.1 R34.2 R41.1 U10.1(VDD) U10.5(VDDA) U10.17(VDD) U16.5(VOUT)
USB5V: C16.1 C17.2 C20.1 C30.1 C31.2 C32.2 C67.1 C80.1 C100.2 C102.2 C103.2 C106.2 C120.2 D72.1(A) F7.1 J7.1 Q6.2(S) R16.1 R19.1 R65.2 U4.1 U7.5(INN) U7.6(INN) U8.7(REGIN) U8.8(VBUS) U9.5(IN) U15.26(SPKVDD) U16.1(VIN) U16.3(EN) U18.8(V+) U19.8(V+) U27.8(V+)
USB5V-IN: F7.2 J1.4(Vbus) J1.9(Vbus) J1.16(Vbus) J1.21(Vbus) R25.1 U11.5(VBUS)
VCC3.3: C3.2 C5.2 C8.1 C9.1 C12.2 C15.1 C59.1 C60.1 C61.1 C62.1 C63.1 C64.1 C66.1 C68.1 C69.1 C70.1 C72.1 C73.1 C74.1 C89.2 C96.2 C99.2 D1.A D2.A D3.A D4.A D5.A D6.A D7.A D8.A F5.2 F6.2 J5.4(VDD) L4.1 L6.1 Mot1.1(TP) R6.2 R7.1 R27.2 R49.2 R51.2 R52.2 R54#2.1 R55#2.1 R59.2 R69.1 R78.1 R93.2 RN4.6 RN4.7 RN4.8 S3.9(B2) S3.10(B1) U1.9(VCC) U1.10(LED_VCC) U2.5(AHLB) U2.6(VDD) U2.8(LPMB) U2.11(OD) U3.6(VBAT) U3.17(VDD) U3.30(VDD) U3.32(VREF+) U3.33(VDDA) U3.39(VDD) U3.52(VDD) U3.62(VDD) U3.72(VDD) U3.84(VDD) U3.95(VDD) U3.108(VDD) U3.121(VDD) U3.131(VDD) U3.143(PDR_ON) U3.144(VDD) U5.5(AHLB) U5.6(VDD) U5.8(LPMB) U5.11(OD) U12.28(VDD) U15.13(DCVDD) U15.14(DBVDD)
VCC3.3A: C94.2 C95.2 L6.2 U15.31(AVDD)
A0: Q3.2 U3.34(PA0/WKUP) U5.14(Q2)
A3: D67.2 P2.31 U3.37(PA3)
A4: D66.2 P2.29 U3.40(PA4)
A5: D65.2 P2.27 U3.41(PA5)
A6: D64.2 P2.25 U3.42(PA6)
A8: D81.2 P1.24 U3.100(PA8)
A9: D31.2 P1.32 U3.101(PA9) U8.25(RXD)  [also labelled TX1]
A15: D76.2 P1.14 U3.110(PA15)
ACTLED: J6#2.12(GLED-) U12.27(ACTLED)
ADC1: D20.K R99.2 U3.36(PA2) U20.7
ADC2: R84.2 U3.35(PA1) U19.1
ADC3: R75.2 U3.43(PA7) U18.1
Au_INL: C92.2 J4.4(D)
Au_INR: C93.2 J4.5(E)
Au_OUTL: C97.2 J3.4(D)
Au_OUTR: C98.2 J3.5(E)
Au_SCL: D36.2 P1.11 U3.139(PB8) U15.16(SCLK)  [also labelled B8]
Au_SDA: R59.1 U3.137(PB7) U15.17(SDIN)
B0: D63.2 P2.23 U3.46(PB0)
B1: D62.2 P2.21 U3.47(PB1)
B3: D84.2 P1.21 R58.1 U1.3(LCD_SCLK) U3.133(PB3)  [also labelled SPI-CLK]
B4: D83.2 P1.19 R67.1 U1.7(LCD_MOSI) U3.134(PB4)  [also labelled SPI-MISO]
B5: D82.2 P1.17 R66.1 U1.6(LCD_MISO) U3.135(PB5)  [also labelled SPI-MOSI]
B6: D38.2 J5.9(CD) P1.15 U3.136(PB6)  [also labelled SD-CD]
B9: D32.2 P1.3 U3.140(PB9) U15.7(LRC)  [also labelled I2S_LRCK]
B13: D24.2 P2.30 U3.74(PB13)
B15: D86.2 P1.13 U3.76(PB15) U15.10(DACDAT)  [also labelled I2S_SDIN]
BELL: R1.1 U3.129(PG14)
BOOT0: R64.1 S3.2(A2) U3.138(BOOT0)
C8: D42.2 J5.7(DAT0) P1.29 U3.98(PC8)  [also labelled SD-DAT0]
C9: D40.2 J5.8(DAT1) P1.27 U3.99(PC9)  [also labelled SD-DAT1]
C10: D37.2 J5.1(DAT2) P1.12 U3.111(PC10)  [also labelled SD-DAT2]
C11: D26.2 J5.2(DAT3) P1.10 U3.112(PC11)  [also labelled SD-DAT3]
C12: D23.2 P1.8 R8.1 U3.113(PC12)  [also labelled SD-CLK]
CHANGEN: J2.4(S_GND) ; off-sheet CHANGEN
D1: D77.2 P1.16 U3.115(PD1)
D2: D22.2 J5.3(CMD) P1.6 U3.116(PD2)  [also labelled SD-CMD]
D3: Q1.2 U2.14(Q2) U3.117(PD3)
D4: D28.2 P1.26 U3.118(PD4)
D5: D48.2 P2.10 U3.119(PD5)
D6: Q2.2 U2.16(Q0) U3.122(PD6)
D7: D75.2 P2.28 U3.123(PD7)
D9: D25.2 P2.22 U3.78(PD9)
D11: D30.2 P1.30 U3.80(PD11)
D12: D51.2 P2.16 U3.81(PD12)
D13: D29.2 P1.28 U3.82(PD13)
D14: D50.2 P2.14 U3.85(PD14)
D15: D49.2 P2.12 U3.86(PD15)
DAC_AO0: D70.2 P3.2 R111.2 U27.7
DAC_AO1: D69.2 P3.1 R110.2 U27.1
DIS_RST#: C7.1 R7.2 U1.2(LCD_RST#) U3.114(PD0)
E0: D80.2 P1.22 U3.141(PE0)
E1: D21.2 P2.32 U3.142(PE1)
E7: D79.2 P1.20 U3.58(PE7)
E8: D59.2 P2.11 U3.59(PE8)
E9: D78.2 P1.18 U3.60(PE9)
E10: D60.2 P2.13 U3.63(PE10)
E11: D85.2 P1.23 U3.64(PE11)
E12: D39.2 P1.25 U3.65(PE12)
E13: D47.2 P2.8 U3.66(PE13)
E14: D46.2 P2.6 U3.67(PE14)
E15: D45.2 P2.4 U3.68(PE15)
EN-3.3V: U9.4(EN) U10.26(PB3)
EXRES1: R43.1 U12.10(EXRES1)
F1: D52.2 P2.18 U3.11(PF1)
F2: D27.2 P2.24 U3.12(PF2)
F3: D53.2 P2.20 U3.13(PF3)
F4: D54.2 P2.26 U3.14(PF4)
F11: D61.2 P2.19 U3.49(PF11)
F12: D44.2 P2.17 U3.50(PF12)
F13: D68.2 P2.15 U3.53(PF13)
F14: D58.2 P2.9 U3.54(PF14)
F15: D57.2 P2.7 U3.55(PF15)
G0: D56.2 P2.5 U3.56(PG0)
G1: D55.2 P2.3 U3.57(PG1)
G2: D43.2 P1.31 U3.87(PG2)
G6: Q4.2 U3.91(PG6) U5.16(Q0)
G7: Q4.1 U3.92(PG7) U5.15(Q1)
G8: Q3.1 U3.93(PG8) U5.13(Q3)
G9: D19.2 P1.4 U3.124(PG9)
G10: Q2.1 U2.15(Q1) U3.125(PG10)
G11: Q1.1 U2.13(Q3) U3.126(PG11)
G12: D35.2 P1.9 U3.127(PG12)
G13: D34.2 P1.7 U3.128(PG13)
G15: D33.2 P1.5 U3.132(PG15)
I2S_MCLK: U3.96(PC6) U15.11(MCLK)
I2S_SCLK: U3.69(PB10) U15.8(BCLK)
I2S_SDOUT: U3.75(PB14) U15.9(ADCDAT)
LCD_CS#: U1.5(LCD_CS#) U3.28(PC2)
LCD_D/C: U1.4(LCD_RS/A0) U3.29(PC3)
LED1: R101.2 U3.20(PF8)
LED2: R102.2 U3.19(PF7)
LED3: R103.2 U3.18(PF6)
LED4: R53.2 R104.2 U3.5(PE6)
LED5: R35.2 R105.2 U3.4(PE5)
LED6: R106.2 U3.3(PE4)
LED7: R107.2 U3.2(PE3)
LED8: R108.2 U3.1(PE2)
LINKLED: J6#2.10(YLED-) U12.25(LINKLED)
M_STM32_SWCLK: R14.1 U3.109(PA14)
M_STM32_SWIO: R5.1 U3.105(PA13)
MDI_RX_N: C52#2.1 R45#2.2 U12.5(RXN)
MDI_RX_P: C51#2.1 R44#2.2 U12.6(RXP)
MDI_TX_N: R42#2.2 T1#2.3(TD-) U12.1(TXN)
MDI_TX_P: R40#2.2 T1#2.1(TD+) U12.2(TXP)
NRST: C78.2 R27.1 U3.25(NRST)
OS32IN: C75.2 U3.8(PC14/OSC32_IN) Y4.2(OSC2)
OS32OUT: C76.2 U3.9(PC15/OSC32_OUT) Y4.1(OSC1)
P_EN: R15#1.1 S3.1(A1)
PMODE0: RN4.1 U12.45(PMODE0)
PMODE1: RN4.2 U12.44(PMODE1)
PMODE2: RN4.3 U12.43(PMODE2)
Power_Key: R34.1 S1.2 U10.19(PA9)
PWM1: U3.21(PF9)
RX1: U3.102(PA10) U8.26(TXD)
RX_N: J6#2.6(J6) T1#2.9(RX-)
RX_P: J6#2.3(J3) T1#2.11(RX+)
STM32_LED1: R62.1 U10.16(PB2)
STM32_LED2: R63.1 U10.15(PB1)
STM32_SWCLK_031: R37.1 U10.24(PA14)
STM32_SWIO_031: R36.1 U10.23(PA13)
T_MOTOR: Q5.1(G) U10.28(PB5)
TOUCH-A: Q1.3 Q2.3 R2.2 U10.25(PA15)
TOUCH-B: Q3.3 Q4.3 R4.2 U10.29(PB6)
TX_N: J6#2.2(J2) T1#2.14(TX-)
TX_P: J6#2.1(J1) T1#2.16(TX+)
TYPE_RX+: J1.11(RX+) J1.23(RX+) R37.2
TYPE_RX-: J1.10(RX-) J1.22(RX-) R36.2
TYPE_TX+: J1.2(TX+) J1.14(TX+) R5.2
TYPE_TX-: J1.3(TX-) J1.15(TX-) R14.2
USB-DM: R17.2 U11.4(IO2)
USB-DP: R18.2 U11.6(IO1)
USB_D+: R50.1 U3.104(PA12)
USB_D-: R33.1 U3.103(PA11)
USB_DM: J1.7(D-) J1.19(D-) U11.3(IO2)
USB_DP: J1.6(D+) J1.18(D+) U11.1(IO1)
W5500_~{RST}: R51.1 U3.10(PF0) U12.37(RSTn)
WINTn: R52.1 U3.7(PC13) U12.36(INTn)
WSCSn: R6.1 U3.15(PF5) U12.32(SCSn)
NetC18_2: C18.2 L1.1 Q6.3(D)
NetC19_1: C19.1 R16.2 U7.4(VIN)
NetC21_2: C21.2 U8.6(VDD)
NetC22_1: C22.1 U7.21(CP)
NetC23_1: C23.1 U7.18(CN)
NetC24_2: C24.2 R20.1 R21.1 U7.22(FBP)
NetC25_1: C25.1 R19.2 U8.9(*RST)
NetC26_1: C26.1 R23.1 R24.2 U7.16(FBN)
NetC28_2: C28.2 R23.2 U7.17(VREF)
NetC33_1: C33.1 D73.K L5.1 U9.6(SW)
NetC33_2: C33.2 D72.2(K) D74.2(K) U9.1(BST)
NetC34_2: C34.2 C58.1 D74.1(A) L5.2 R38.2 R49.1
NetC37_1: C37.1 D71.K L3.1 U14.6(SW)
NetC37_2: C37.2 U14.1(BST)
NetC46_2: C46.2 U10.2(PF0-OSC_IN) Y1.3(OUT)
NetC47_1: C47.1 U10.3(PF1-OSC_OUT) Y1.1(IN)
NetC48_1: C48.1 R41.2 U10.4(NRST)
NetC49#2_2: C49#2.2 R22#2.2 T1#2.2(TCT)
NetC50#2_1: C50#2.1 R44#2.1 R45#2.1 T1#2.7(RCT)
NetC51#2_2: C51#2.2 T1#2.6(RD+)
NetC52#2_2: C52#2.2 T1#2.8(RX-)
NetC53_2: C53.2 U12.20(TOCAP)
NetC54_2: C54.2 U12.22(1V2O)
NetC55#2_1: C55#2.1 R46#2.1 R48#2.1
NetC56_2: C56.2 C57.1 L3.2 R31.2 R65.1
NetC65_2: C65.2 R60.2 U12.31(XO) Y2.1(OE)
NetC71_2: C71.2 R60.1 U12.30(XI/CLCKIN) Y2.3(OUT)
NetC77_2: C77.2 R3.1 U3.24(PH1/OSC_OUT) Y3.1(X1)
NetC79_2: C79.2 R3.2 U3.23(PH0/OSC_IN) Y3.3(X2)
NetC81_1: C81.1 U16.4(BP)
NetC83_2: C83.2 R35.1 R56.2
NetC84_2: C84.2 R53.1 R57.2
NetC85_2: C85.2 R56.1 U27.3(+)
NetC86_2: C86.2 R57.1 U27.5(+)
NetC88_1: C88.1 U15.2(LIN)
NetC91_1: C91.1 U15.5(RIN)
NetC92_1: C92.1 U15.3(L2/GPIO2)
NetC93_1: C93.1 U15.6(R2/GPIO3)
NetC97_1: C97.1 U15.30(LOUT1)
NetC98_1: C98.1 U15.29(ROUT1)
NetC128_1: C128.1 U3.106(VCAP_2)
NetC129_1: C129.1 U3.71(VCAP_1)
NetD1_K: D1.K R101.1
NetD2_K: D2.K R102.1
NetD3_K: D3.K R103.1
NetD4_K: D4.K R104.1
NetD5_K: D5.K R105.1
NetD6_K: D6.K R106.1
NetD7_K: D7.K R107.1
NetD8_K: D8.K R108.1
NetD9_A: D9.A L1.2 U7.1(INP) U7.24(INP)
NetD10_K: D10.K L2.2 U7.13(OUTN) U7.14(OUTN)
NetD11_A: D11.A R25.2
NetD12_K: D12.K R26.2
NetD13_K: D13.K R28.2
NetD14_K: D14.K R29.2
NetD15_K: D15.K D16.A F3.2
NetD17_K: D17.K R62.2
NetD18_K: D18.K R63.2
NetF1_1: F1.1 P3.10
NetF2_1: F2.1 P3.9
NetF3_1: F3.1 J2.5(VCC)
NetF5_1: F5.1 P1.1
NetF6_1: F6.1 P2.1
NetJ5_5: J5.5(CLK) R8.2
NetJ6#2_9: J6#2.9(YLED+) R54#2.2
NetJ6#2_11: J6#2.11(GLED+) R55#2.2
NetJ7_2: J7.2 R33.2
NetJ7_3: J7.3 R50.2
NetJ8_1: J8.1 R9.1
NetMot2_1: Mot2.1(TP) Q5.3(D)
NetP4_1: P4.1 U15.25(LOUT2)
NetP5_1: P5.1 U15.23(ROUT2)
NetQ6_1: Q6.1(G) U7.7(BSW)
NetQ7_B: Q7.B R1.2
NetQ7_C: Q7.C U4.2
NetR9_2: R9.2 R10.1 R72.2
NetR11_2: R11.2 U2.9(MOT0)
NetR12_2: R12.2 R110.1 U27.2(-)
NetR13_2: R13.2 U5.9(MOT0)
NetR15#1_2: R15#1.2 R15#2.2 U7.8(ENP) U7.9(PSP) U7.10(ENN) U7.11(PSN)
NetR17_1: R17.1 U8.5(D-)
NetR18_1: R18.1 U8.4(D+)
NetR30_2: R30.2 U14.4(EN)
NetR31_1: R31.1 R32.2 U14.3(FB)
NetR38_1: R38.1 R39.2 U9.3(FB)
NetR46#2_2: R46#2.2 T1#2.10(CMR)
NetR47_2: R47.2 U12.23(RSVD)
NetR48#2_2: R48#2.2 T1#2.15(CMT)
NetR58_2: R58.2 U12.33(SCLK)
NetR61_1: R61.1 U15.18(MODE)
NetR66_2: R66.2 U12.35(MOSI)
NetR67_2: R67.2 U12.34(MISO)
NetR69_2: R69.2 R70.1 R73.2
NetR71_2: R71.2 R75.1 U18.2(-)
NetR72_1: R72.1 R73.1 R74.1 U18.3(+)
NetR76_2: R76.2 R77.1 R81.2
NetR78_2: R78.2 R79.1 R82.2
NetR80_2: R80.2 R84.1 U19.2(-)
NetR81_1: R81.1 R82.1 R83.1 U19.3(+)
NetR85_1: R85.1 R86.2 R89.1
NetR87_1: R87.1 R88.2 R90.2
NetR89_2: R89.2 R92.1 U20.2(-)
NetR90_1: R90.1 R91.1 U20.3(+)
NetR92_2: R92.2 R96.1 U20.1
NetR93_1: R93.1 R94.2 R97.1
NetR95_2: R95.2 R99.1 U20.6(-)
NetR96_2: R96.2 R97.2 R98.2 U20.5(+)
NetR109_2: R109.2 R111.1 U27.6(-)
NetR115_1: R115.1 U1.11(LED_GDN1) U1.12(LED_GDN2) U1.13(LED_GDN3) U1.14(LED_GDN4)
NetRN4_4: RN4.4 U12.42(RSVD)
NetRN5_1: RN5.1 U12.41(RSVD)
NetRN5_2: RN5.2 U12.40(RSVD)
NetRN5_3: RN5.3 U12.39(RSVD)
NetRN5_4: RN5.4 U12.38(RSVD)
NetTP1_1: TP1.1(TP) U2.2(IN1)
NetTP2_1: TP2.1(TP) U2.3(IN2)
NetTP3_1: TP3.1(TP) U2.4(IN3)
NetTP4_1: TP4.1(TP) U2.1(IN0)
NetTP5_1: TP5.1(TP) U5.2(IN1)
NetTP6_1: TP6.1(TP) U5.4(IN3)
NetTP7_1: TP7.1(TP) U5.3(IN2)
NetTP8_1: TP8.1(TP) U5.1(IN0)

Not connected (* = marked no-connect by the designer): J1 5(CC1) 8(SBU1) 17(CC2) 20(SBU2); J3 2(B) 3(C); J4 2(B) 3(C); J6#2 4(J4)* 5(J5)* 7(J7)* 8(J8)*; P1 34; P2 34; S3 3(A3) 4(A4) 5(A5) 6(B5) 7(B4) 8(B3); U1 15(TOUCH_XL)* 16(TOUCH_YU)* 17(TOUCH_XR)* 18(TOUCH_TD)*; U2 12(SM)*; U3 22(PF10) 26(PC0) 27(PC1) 44(PC4) 45(PC5) 48(PB2/BOOT1) 70(PB11) 73(PB12) 77(PD8) 79(PD10) 88(PG3) 89(PG4) 90(PG5) 97(PC7); U5 12(SM)*; U7 12(NC)* 20(NC)*; U8 1(DCD)* 2(RI)* 10(NC)* 11(*SUSPEND)* 12(SUSPEND) 13(NC)* 14(NC)* 15(NC)* 16(NC)* 17(NC)* 18(NC)* 19(NC)* 20(NC)* 21(NC)* 22(NC)* 23(CTS)* 24(RTS)* 27(DSR)* 28(DTR)*; U10 6(PA0) 7(PA1) 8(PA2) 9(PA3) 10(PA4) 11(PA5) 12(PA6) 13(PA7) 14(PB0) 18(PA8) 20(PA10) 21(PA11) 22(PA12) 27(PB4) 30(PB7) 32(PB8); U12 7(DNC)* 12(NC)* 13(NC)* 18(VBG)* 24(SPDLED)* 26(DUPLED)* 46(NC)* 47(NC)*; U15 1(LIP) 4(RIP) 15(CSB/GPIO1) 19(AUXL) 20(AUXR) 21(OUT4) 22(OUT3) 27(VMID) 32(MICBIAS); Y1 2(GND) 4(GND); Y2 2(GND) 4(VCC); Y3 2(GND) 4(GND)

## Layout directives
differential pair: (no net found under the mark), RX_N, RX_P, TX_N, TX_P

## Notes on the sheet
- (near C27) max: 1000mA
- (near J5) 要接5V转3.3 V的电平转换器
- SD-Card-SPI
- max: 1000mA
- Labels drawn without touching a wire or pin: 1.20V, 1.28V, 2路DA, 34, 91, 92, 93, 117, 122, 125, 126, 433, 2023-4-4, -58MV, A, A0, A_ADC_Single_In, AA, ADC气体, ADC电池, AIXIN, Au_SCL, Au_SDA, B, B6, BB, C, C8, C9, C10, C11, C12, C13, C26 不能焊接  焊了就震荡, CC, D, D0, D1, D2, D3, D4, D5, D6, D7, DD, DN, F0, F5, G6, G7, G8, G10, G11, I2S_LRCK, I2S_MCLK, I2S_SCLK, I2S_SDIN, I2S_SDOUT, IO, LCD_CS#, LCD_D/C, LL, PA13, PA14, PB7, PB8, PB9, PB10, PB12, PB13, PB14, PB15, PC2, PC3, PC6, PWM加热, RR, RX1, RX2, RX3, RX4, SD-CD, SD-CLK, SD-CMD, SD-DAT0, SD-DAT1, SD-DAT2, SD-DAT3, SPI-CLK, SPI-MISO, SPI-MOSI, STM32口袋机-V4, TX1, TX2, TX3, TX4, UP, W5500_~{RST}, WINTn, WSCSn, ZGYZ, ZP, 中断震动, 垃圾桶, 小车, 屏的复位连接到了407的PD0-114脚, 差分AD, 接FPGA, 焊盘下面已经连接, 音频的AGND没有连接, 风扇PWM
- (in symbol LCD_SPI_18P) 240*320 LCD SPI

## Library data of the parts
C3 C5 C7-C9 C12 C16-C29 C31-C39 C41 C46-C48 C49#1 C49#2 C50#1 C50#2 C51#1 C51#2 C52#1 C52#2 C55#1 C55#2 C56 C67 C75 C76 C80-C82 C89 C128 C129 = CAP: Capacitor
C15 C59-C64 C66 C68-C70 C72-C74 C78 C94 C96 C100 C102-C105 C120 C?#2-C?#5 C?#8 = C0603
C30 C57 C58 = C+: 10uF
C40 C42-C45 C53 C54 C101 = Cap Semi: Capacitor (Semiconductor SIM Model); Published: 8-Jun-2000; LatestRevisionDate: 29-May-2009; LatestRevisionNote: IPC-7351 Footprint Added.; PackageReference: C1206; Publisher: Altium Limited; PackageDescription: Chip Capacitor
  C40: Value: 10UF 10V
  C42-C45 C54 C101: Value: 100NF
  C53: Value: 4.7UF 10V
C65 C71 = C_2: Value: 18pF
C77 C79 C83-C86 C88 C91-C93 C95 C97-C99 C106 C?#1 C?#6 C?#7 = C0603: 100NF
C?#9 = C0805: 100NF
D1-D8 D11-D14 D17 D18 = LED
D9 D10 D15 D16 D20 D71 D73 = DIODE
D19 D21-D40 D42-D70 D75-D86 = TVS-SMA: High Conductance Fast Diode; Published: 8-Jun-2000; LatestRevisionDate: 17-Jul-2002; LatestRevisionNote: Re-released for DXP Platform.; DatasheetVersion: 1997; PackageReference: DO-35; Publisher: Altium Limited; PackageDescription: Diode, Axial; Body 3.8 x 1.9 mm (LxDia. max), Lead Dia. 0.53 mm (max); Code_JEDEC: DO-204-AH; ComponentLink1Description: Manufacturer Link; ComponentLink1URL: http://www.fairchildsemi.com/; ComponentLink2Description: Datasheet; ComponentLink2URL: http://www.fairchildsemi.com/ds/1N%2F1N4448.pdf
D72 D74 = DD: High Conductance Fast Diode; Published: 8-Jun-2000; LatestRevisionDate: 17-Jul-2002; LatestRevisionNote: Re-released for DXP Platform.; DatasheetVersion: 1997; PackageReference: DO-35; Publisher: Altium Limited; PackageDescription: Diode, Axial; Body 3.8 x 1.9 mm (LxDia. max), Lead Dia. 0.53 mm (max); Code_JEDEC: DO-204-AH; ComponentLink1Description: Manufacturer Link; ComponentLink1URL: http://www.fairchildsemi.com/; ComponentLink2Description: Datasheet; ComponentLink2URL: http://www.fairchildsemi.com/ds/1N%2F1N4448.pdf
F1-F3 = Fuse 2: Fuse; Published: 8-Jun-2000; LatestRevisionDate: 17-Jul-2002; LatestRevisionNote: Re-released for DXP Platform.; PackageReference: PIN-W2/E2.8; Publisher: Altium Limited
F5-F7 = Fuse0805: Fuse1206; Published: 8-Jun-2000; LatestRevisionDate: 17-Jul-2002; LatestRevisionNote: Re-released for DXP Platform.; PackageReference: PIN-W2/E2.8; Publisher: Altium Limited; PackageDescription: Thru-Hole; 2 Leads
J2 = DC-5mm
J3 J4 = PJ381
J5 = MicroSD-PUSH: MicroSD Card PUSH with CD pin
J6#1 J6#2 = RJ45_8P8CS_DIP
J7 = USB A-TYPE: USB A TYPE
J8 = SMA_V
L1-L3 L5 = INDUCTOR
L4 L6 L? = Inductor: Code_IEC: 1005; Published: 8-Jun-2000; LatestRevisionDate: 29-May-2009; LatestRevisionNote: IPC-7351 Footprint Added.; PackageReference: 0402-A; Publisher: Altium Limited; PackageDescription: Chip Inductor; Code_JEITA: 0402
Mot1 Mot2 = TP
P1 P2 = Header 17X2: Header, 17-Pin, Dual row; LatestRevisionDate: 17-Jul-2002; LatestRevisionNote: Re-released for DXP Platform.; Publisher: Altium Limited
P3 = Header 10: Header, 10-Pin; LatestRevisionDate: 17-Jul-2002; LatestRevisionNote: Re-released for DXP Platform.; Publisher: Altium Limited
P4 P5 = SIP1: Header, 2-Pin; LatestRevisionDate: 17-Jul-2002; LatestRevisionNote: Re-released for DXP Platform.; Publisher: Altium Limited
Q5 = NMOS-2: N-Channel Power MOSFET; Note: Pin 2 is electrically connected to pin 4.; Published: 8-Jun-2000; LatestRevisionDate: 17-Jul-2002; LatestRevisionNote: Re-released for DXP Platform.; DatasheetVersion: PD-9.814; PackageVersion: Feb-1997; PackageReference: TO-220AB; Publisher: Altium Limited; PackageDescription: TO, Thru-Hole, Vertical, Heatsink Mounted; 3 In-Line Leads; Pitch 2.54 mm; ComponentLink1Description: Manufacturer Link; ComponentLink1URL: http://www.irf.com/
Q6 = PMOS-2: P-Channel Power MOSFET; Note: Pin 4 not drawn and electrically connected to Pin 2.; Published: 8-Jun-2000; LatestRevisionDate: 17-Jul-2002; LatestRevisionNote: Re-released for DXP Platform.; DatasheetVersion: PD-9.390D; PackageVersion: Feb-1997; PackageReference: TO-220AB; Publisher: Altium Limited; PackageDescription: TO, Thru-Hole, Vertical, Heatsink Mounted; 3 In-Line Leads; Pitch 2.54 mm; ComponentLink1Description: Manufacturer Link; ComponentLink1URL: http://www.irf.com/
Q7 = 8050: 三极管; Published: 8-Jun-2000; LatestRevisionDate: 17-Jul-2002; LatestRevisionNote: Re-released for DXP Platform.; PackageReference: TO-226-AA; Publisher: Altium Limited; PackageDescription: TO, Flat Index; 3 In-Line, Axial Leads; Body Dia. 4.8mm; Leads 0.55 x 0.51 mm (max); Code_JEDEC: TO-226-AA
R1 R3 R8 R12 R27 R33-R35 R50 R53 R56 R57 R59 R61 R64 R101-R111 R?#1-R?#4 = R-0402
R2 R4 R5 R7 R9-R11 R13 R14 R15#1 R15#2 R16-R21 R22#1 R22#2 R23-R26 R28-R32 R36-R39 R40#1 R40#2 R41 R42#1 R42#2 R44#1 R44#2 R45#1 R45#2 R46#1 R46#2 R48#1 R48#2 R49 R54#1 R54#2 R55#1 R55#2 R62 R63 R65 R69-R99 = RES1
R6 R43 R51 R52 = Res2: 不焊; Published: 8-Jun-2000; LatestRevisionDate: 17-Jul-2002; LatestRevisionNote: Re-released for DXP Platform.; PackageReference: AXIAL-0.4; Publisher: Altium Limited
  R6: Value: 10K
  R43: Value: 12.4k(1%)
  R51 R52: Value: 10k
R47 R60 = Res2: Resistor; Published: 8-Jun-2000; LatestRevisionDate: 17-Jul-2002; LatestRevisionNote: Re-released for DXP Platform.; PackageReference: AXIAL-0.4; Publisher: Altium Limited; PackageDescription: Axial Device, Thru-Hole; 2 Leads; 0.4 in Pin Spacing
  R47: Value: 10K
  R60: Value: 1M
R58 R66 R67 = Res2: Published: 8-Jun-2000; LatestRevisionDate: 17-Jul-2002; LatestRevisionNote: Re-released for DXP Platform.; PackageReference: AXIAL-0.4; Publisher: Altium Limited; Value: 100R
R115 = R-0603
RN4 RN5 = Res Pack4: Isolated Resistor Network
S1 = SW-PB
S3 = SW DIP-5: DIP Switch
U4 = BELL
U7 = TPS65131
U12 = W5500: W5500以太网芯片
U16 = RT9193
U18-U20 U27 = AMP-2
U? = LAN8720: 芯片以太网
Y1 Y2 = XTAL
Y3 Y? = XTAL-4-W: Crystal Oscillator; Published: 8-Jun-2000; LatestRevisionDate: 17-Jul-2002; LatestRevisionNote: Re-released for DXP Platform.; PackageReference: R38; Publisher: Altium Limited; PackageDescription: Crystal, Thru-Hole; 2 Leads; Body 3.1 x 8.2 mm (Dia.xH)
Y4 = XTAL: Crystal Oscillator; Published: 8-Jun-2000; LatestRevisionDate: 17-Jul-2002; LatestRevisionNote: Re-released for DXP Platform.; PackageReference: R38; Publisher: Altium Limited